# EasyEDA Pro project ProDoc_D133手机主板V0.2_2024-07-06.epro, schematic Schematic1_1

## Sheets
1 MCU
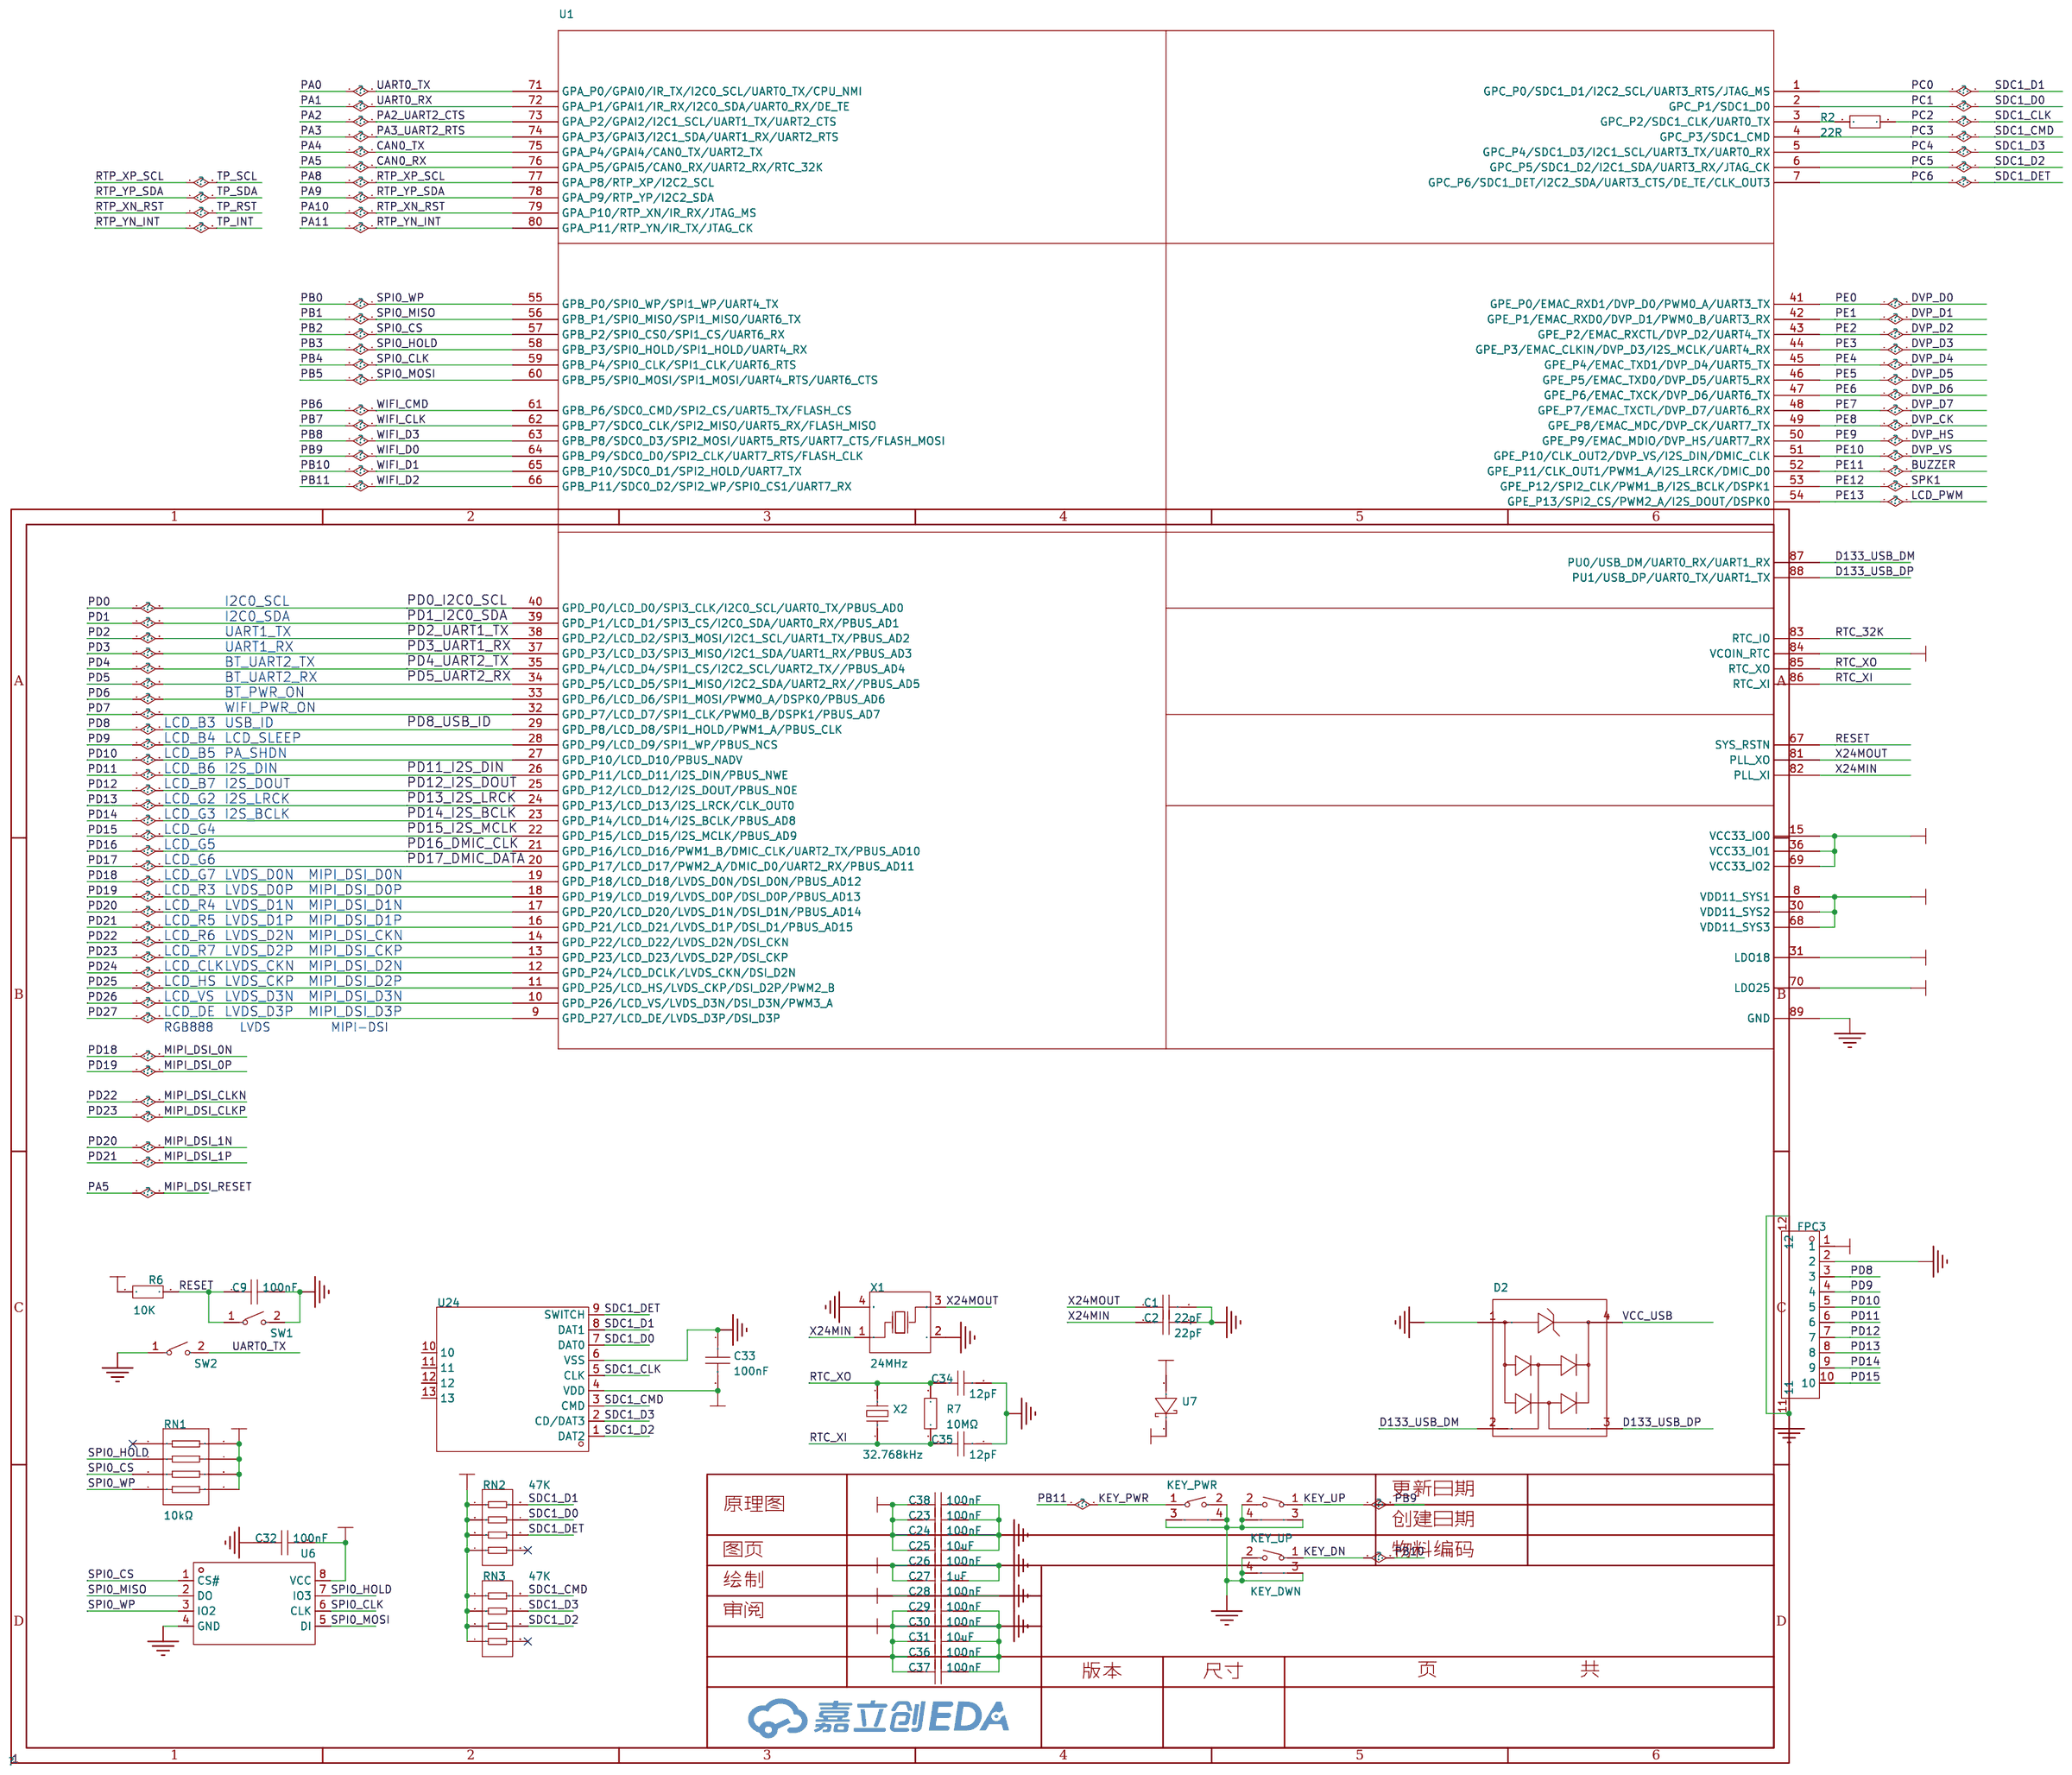
[diagram p0: MCU]
2 LCD
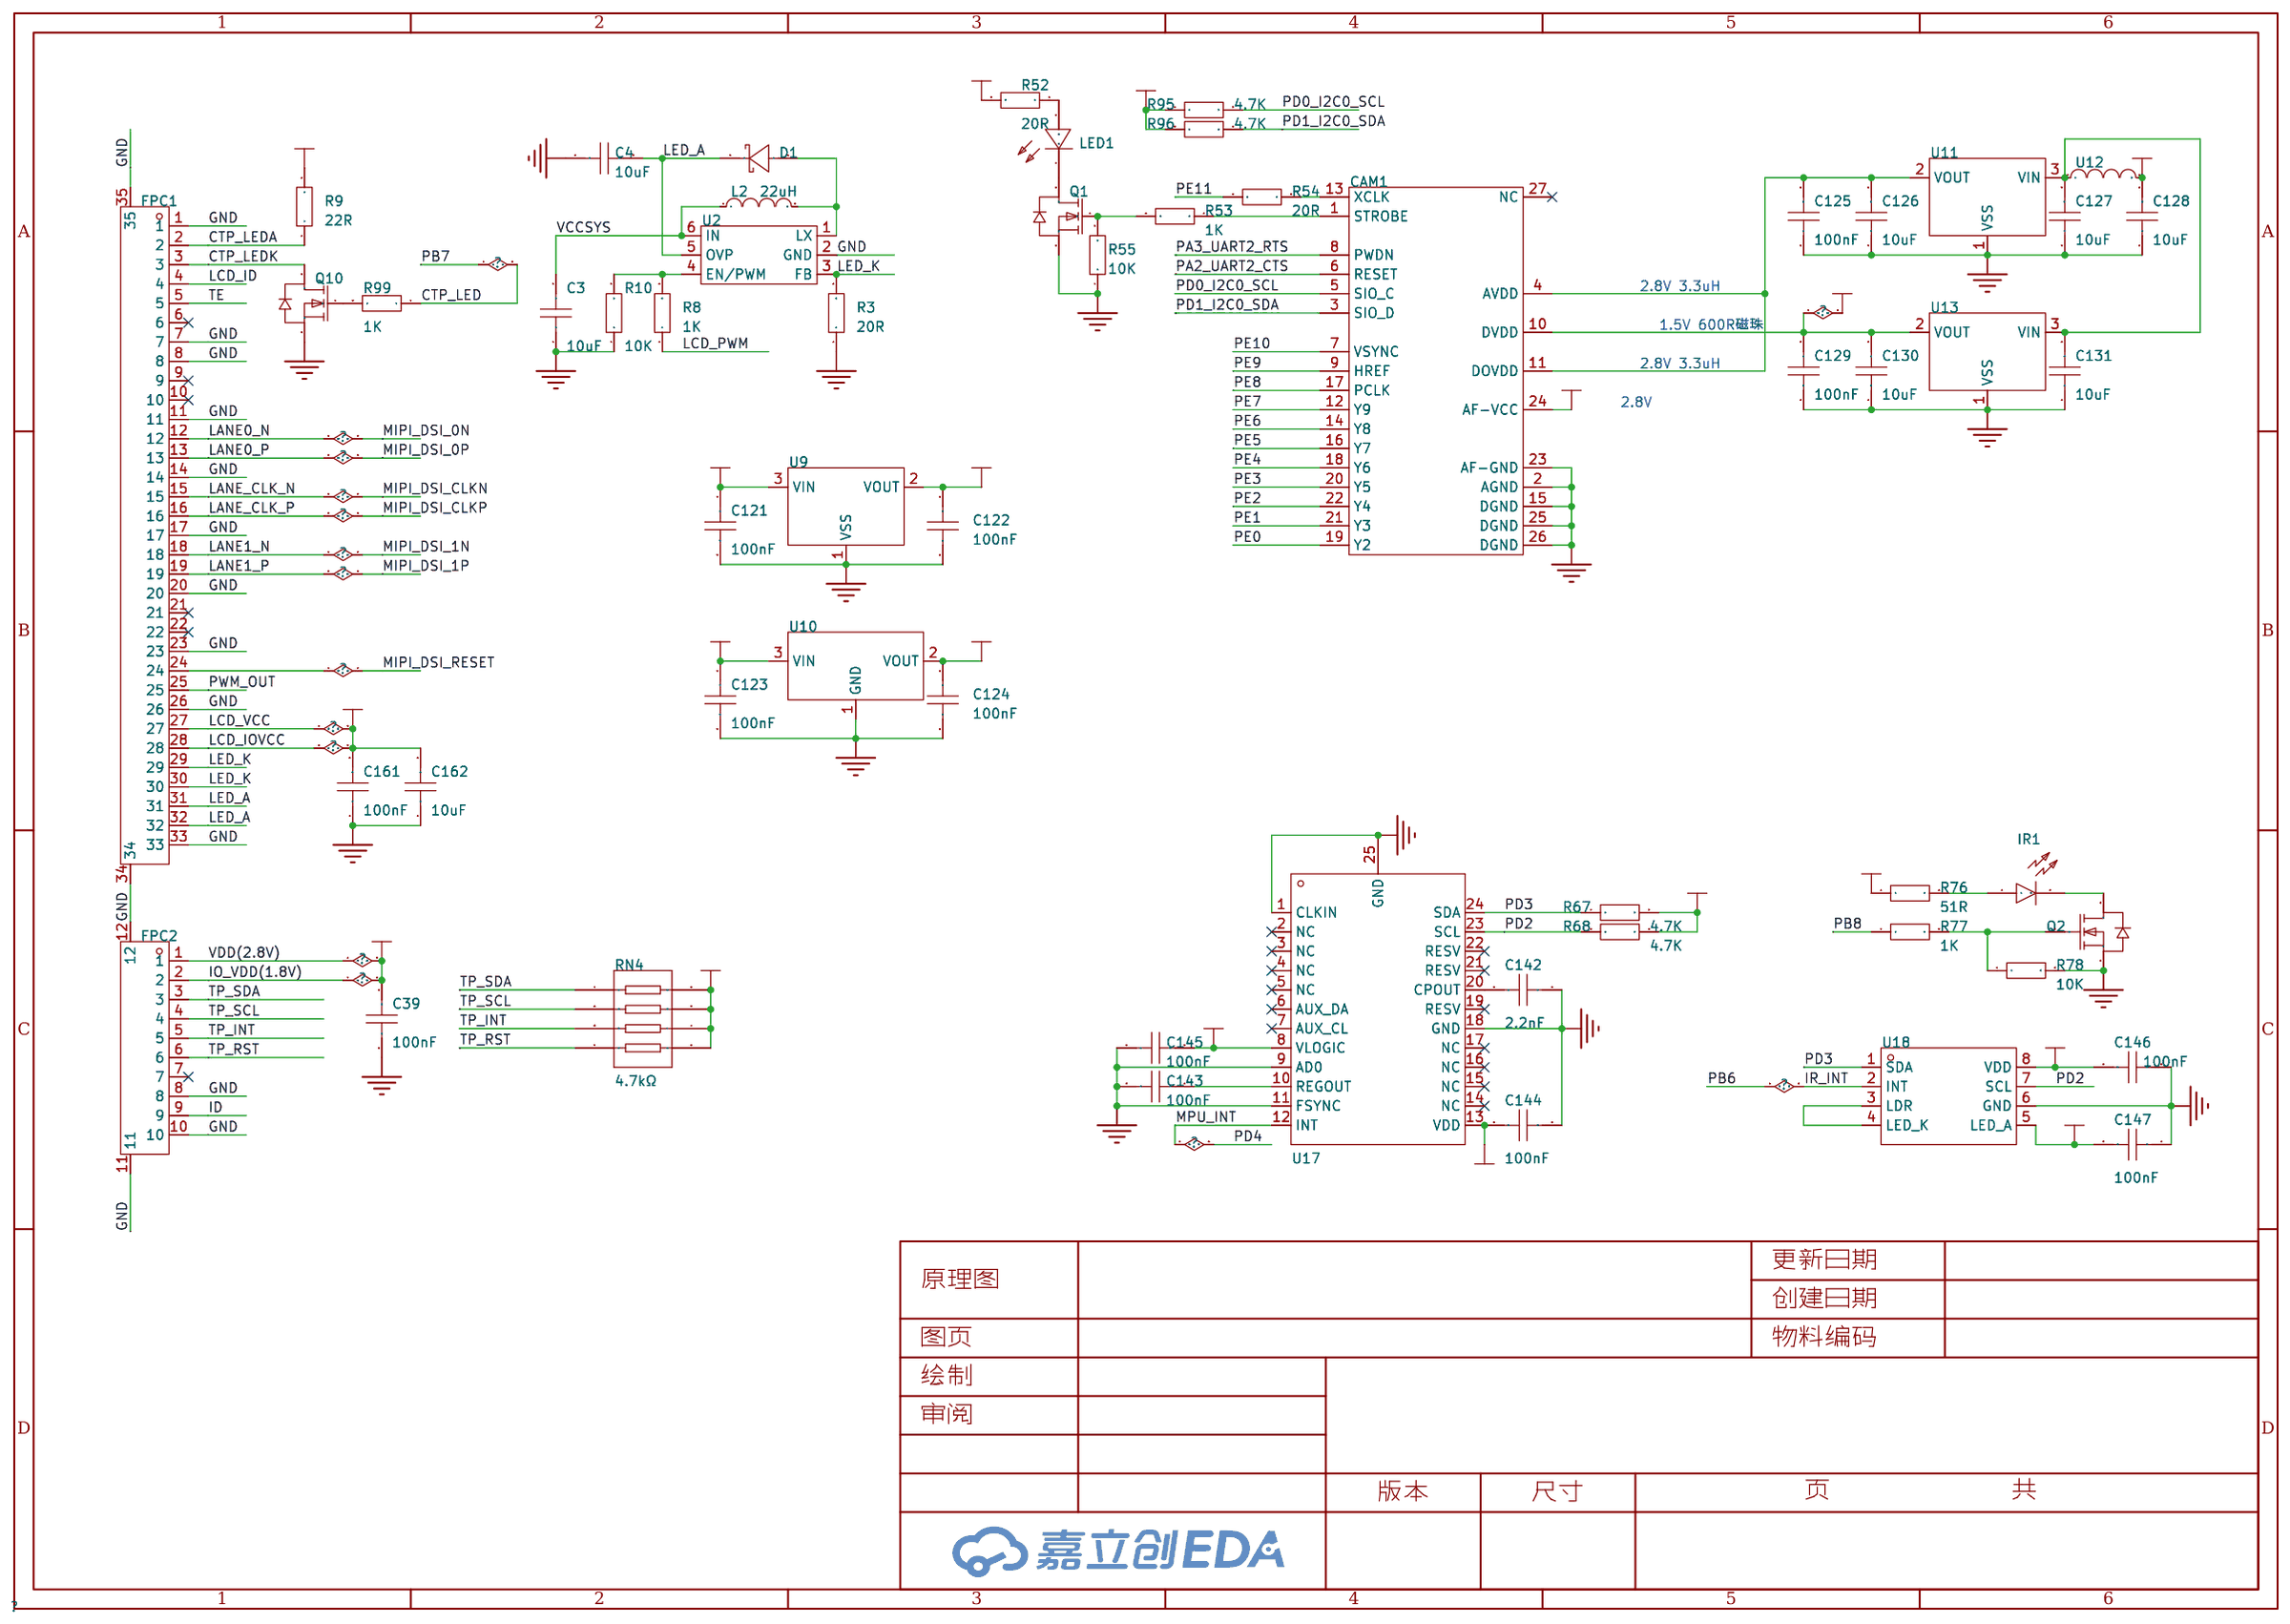
[diagram p1: LCD]
3 POWER
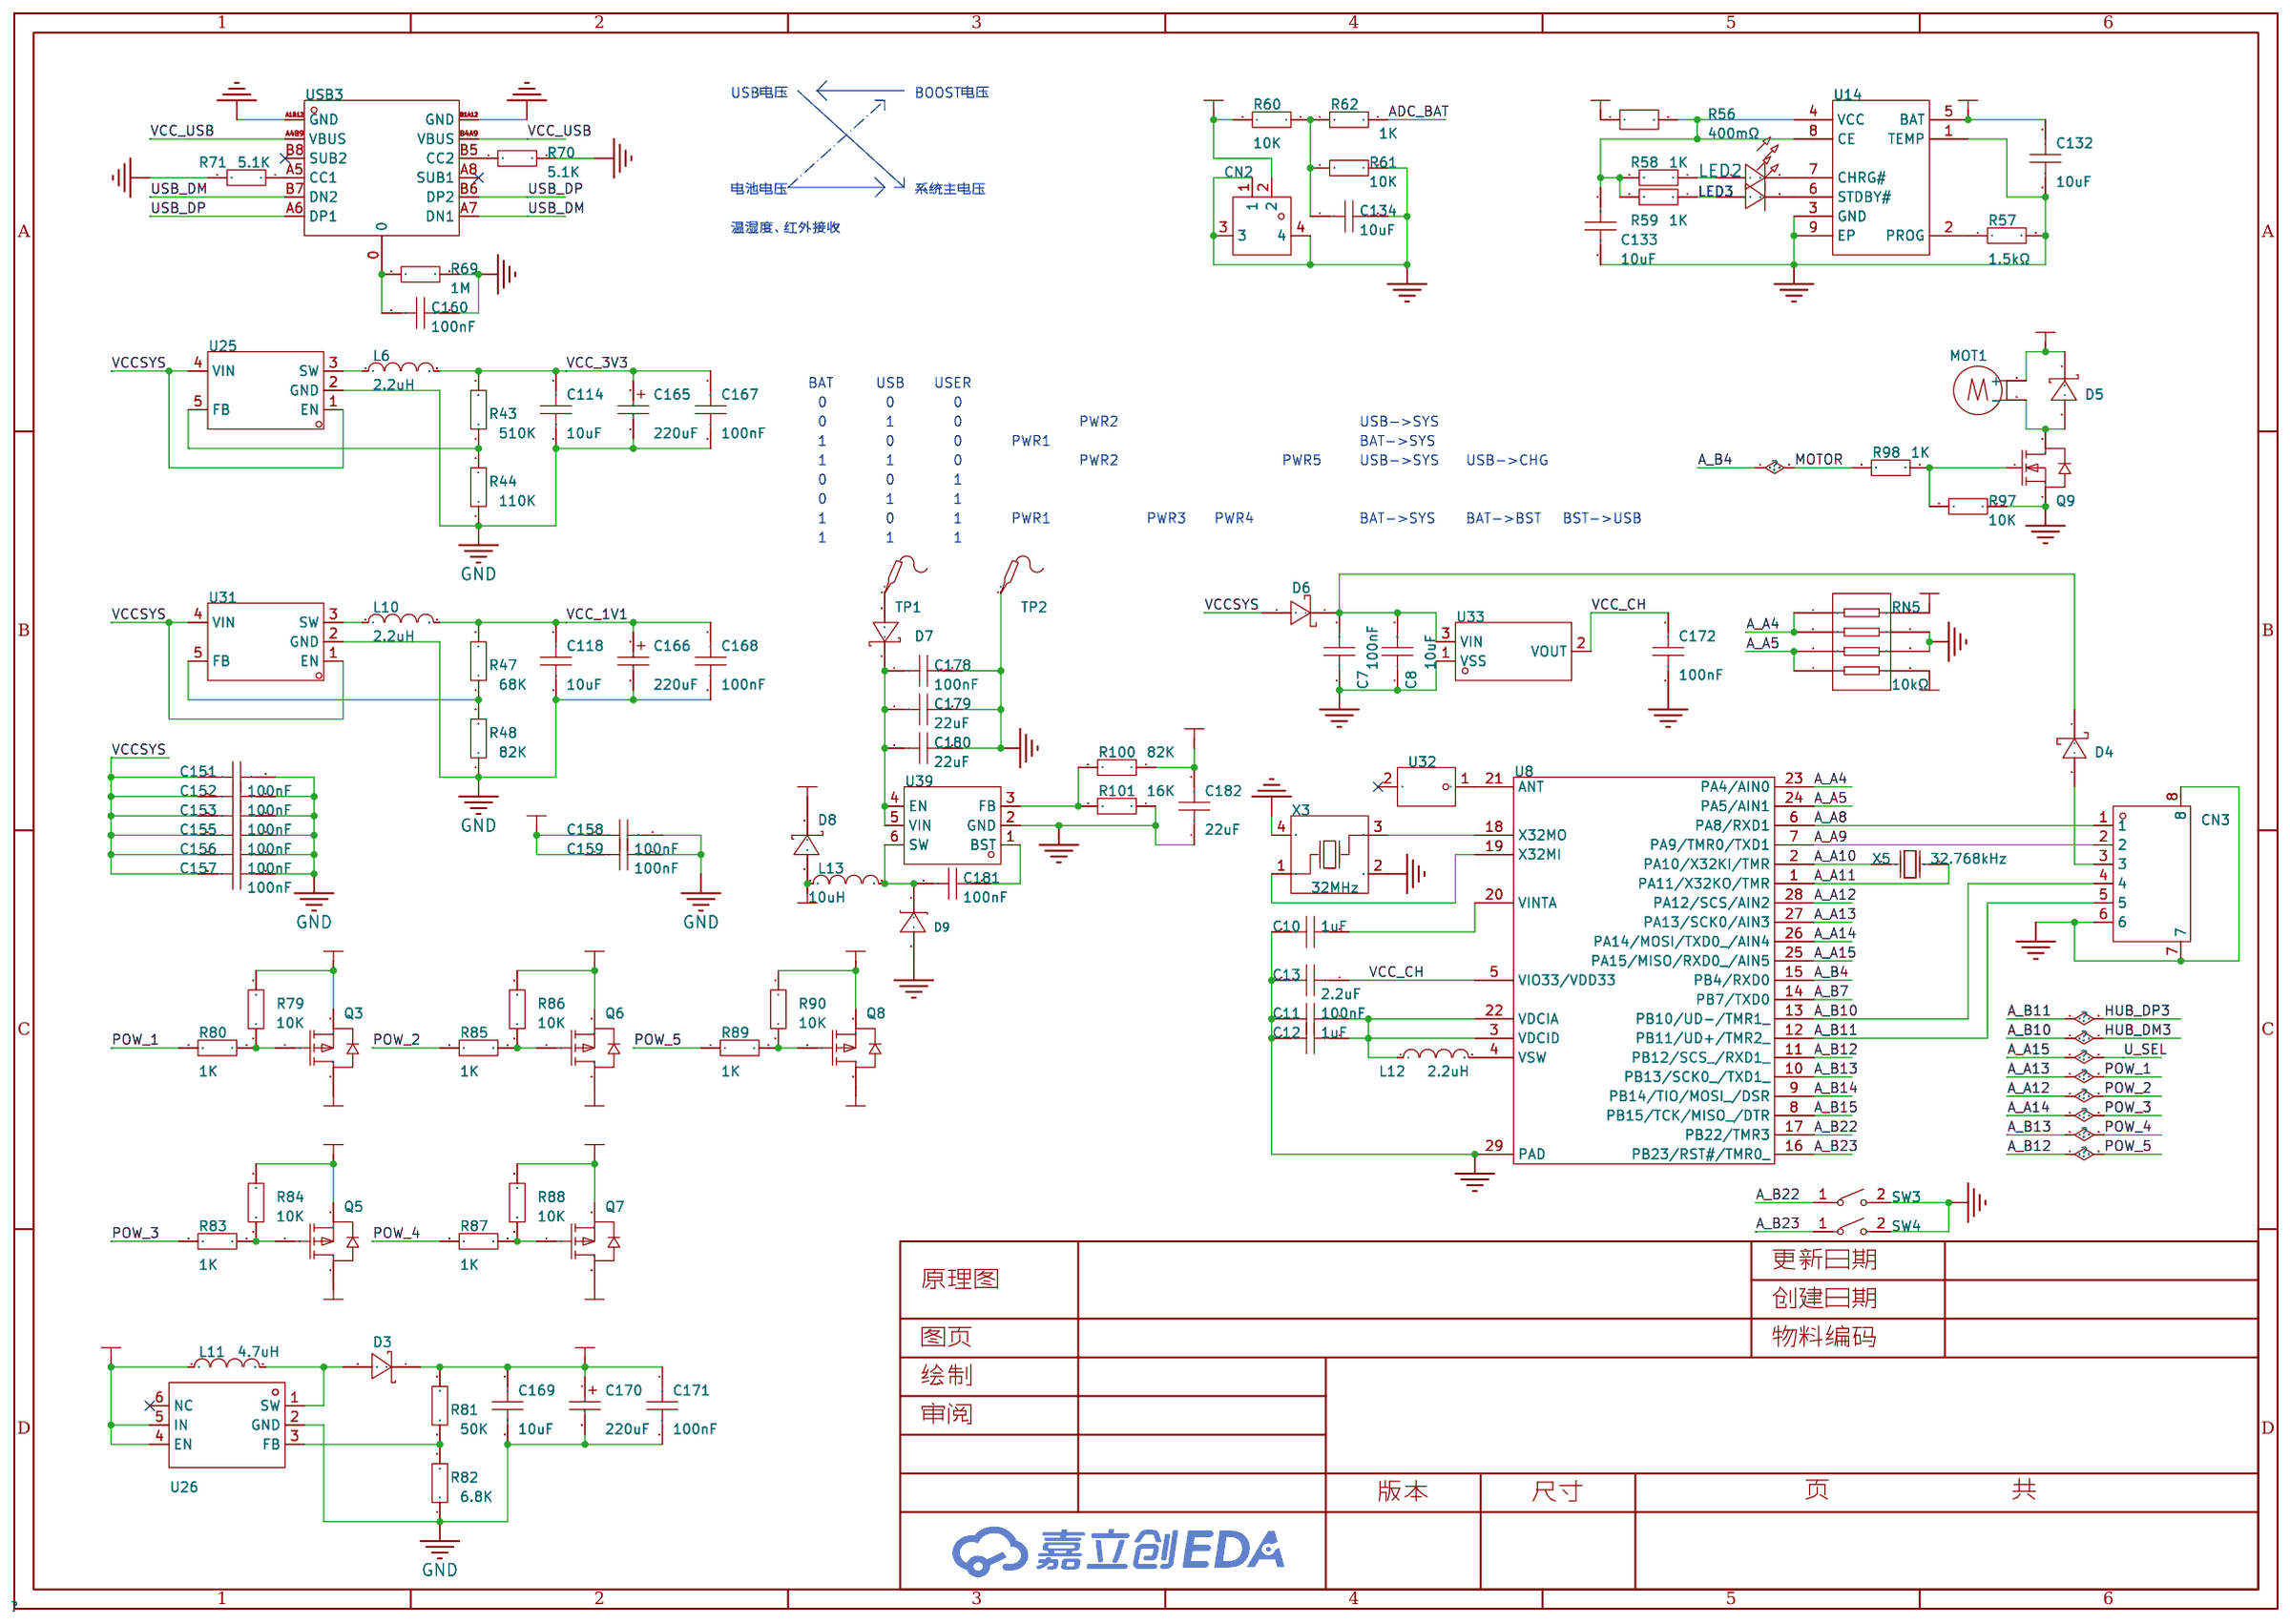
[diagram p2: POWER]
4 AUDIO
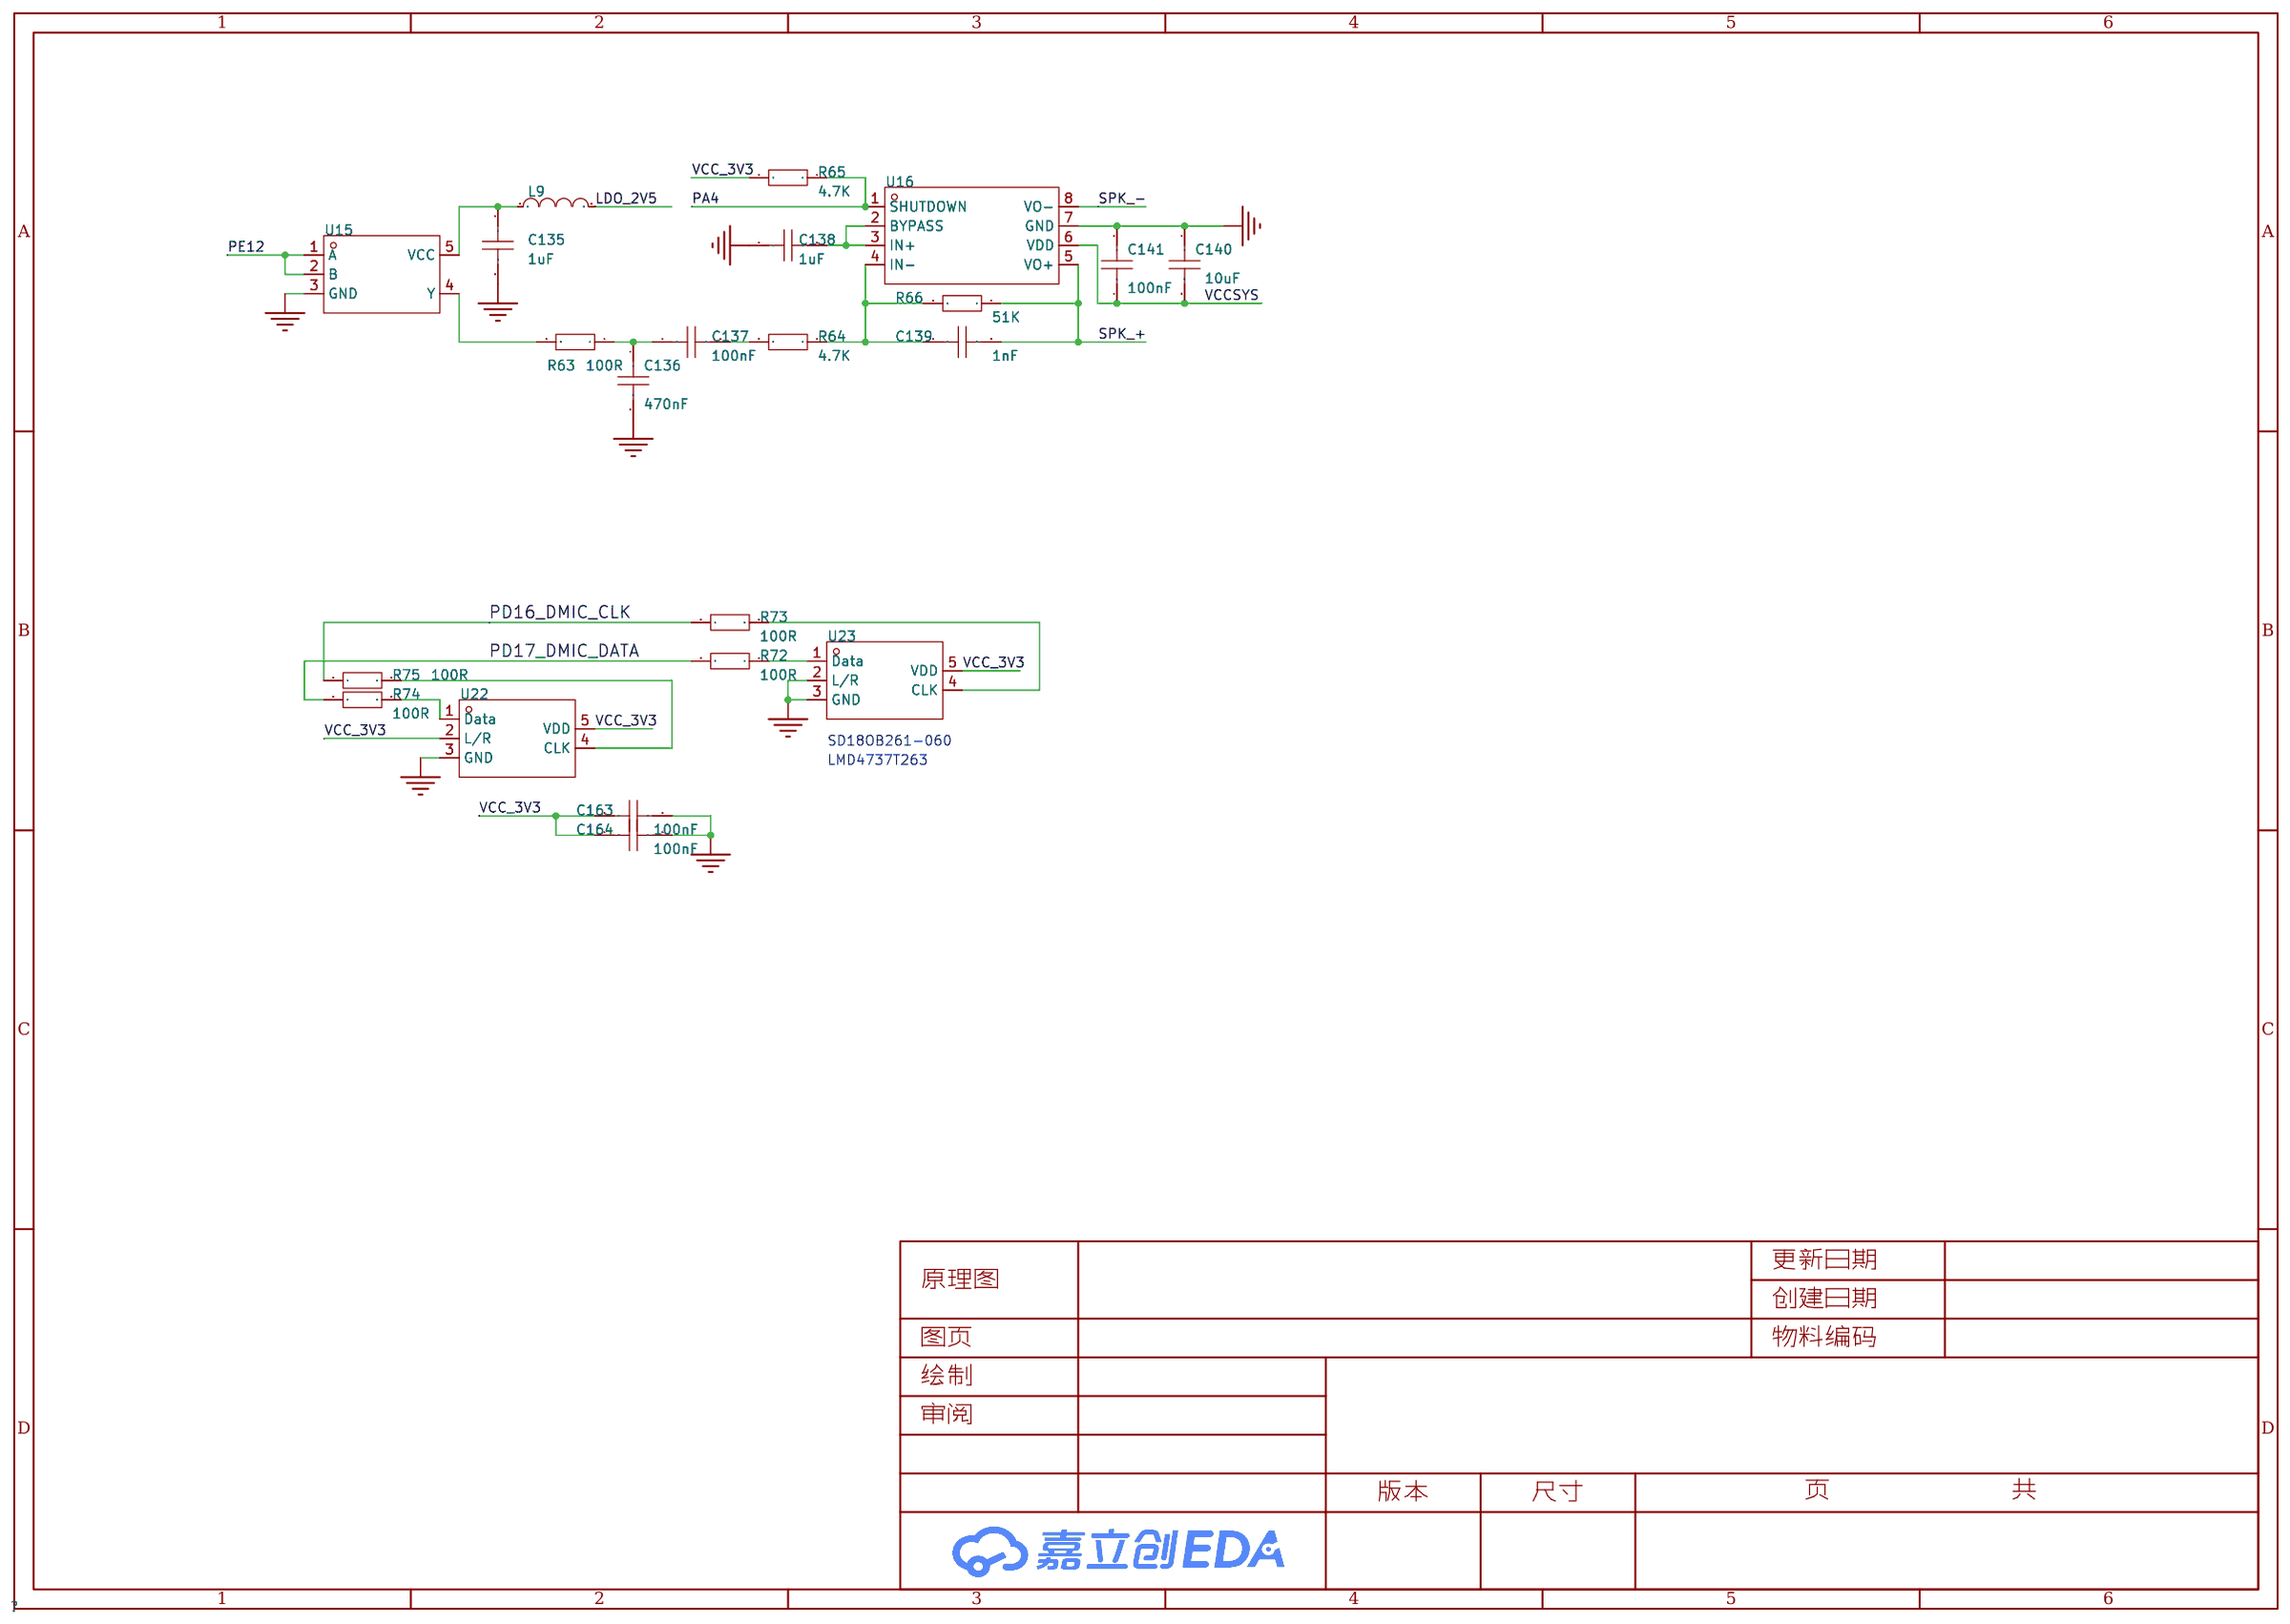
[diagram p3: AUDIO]
5 USB
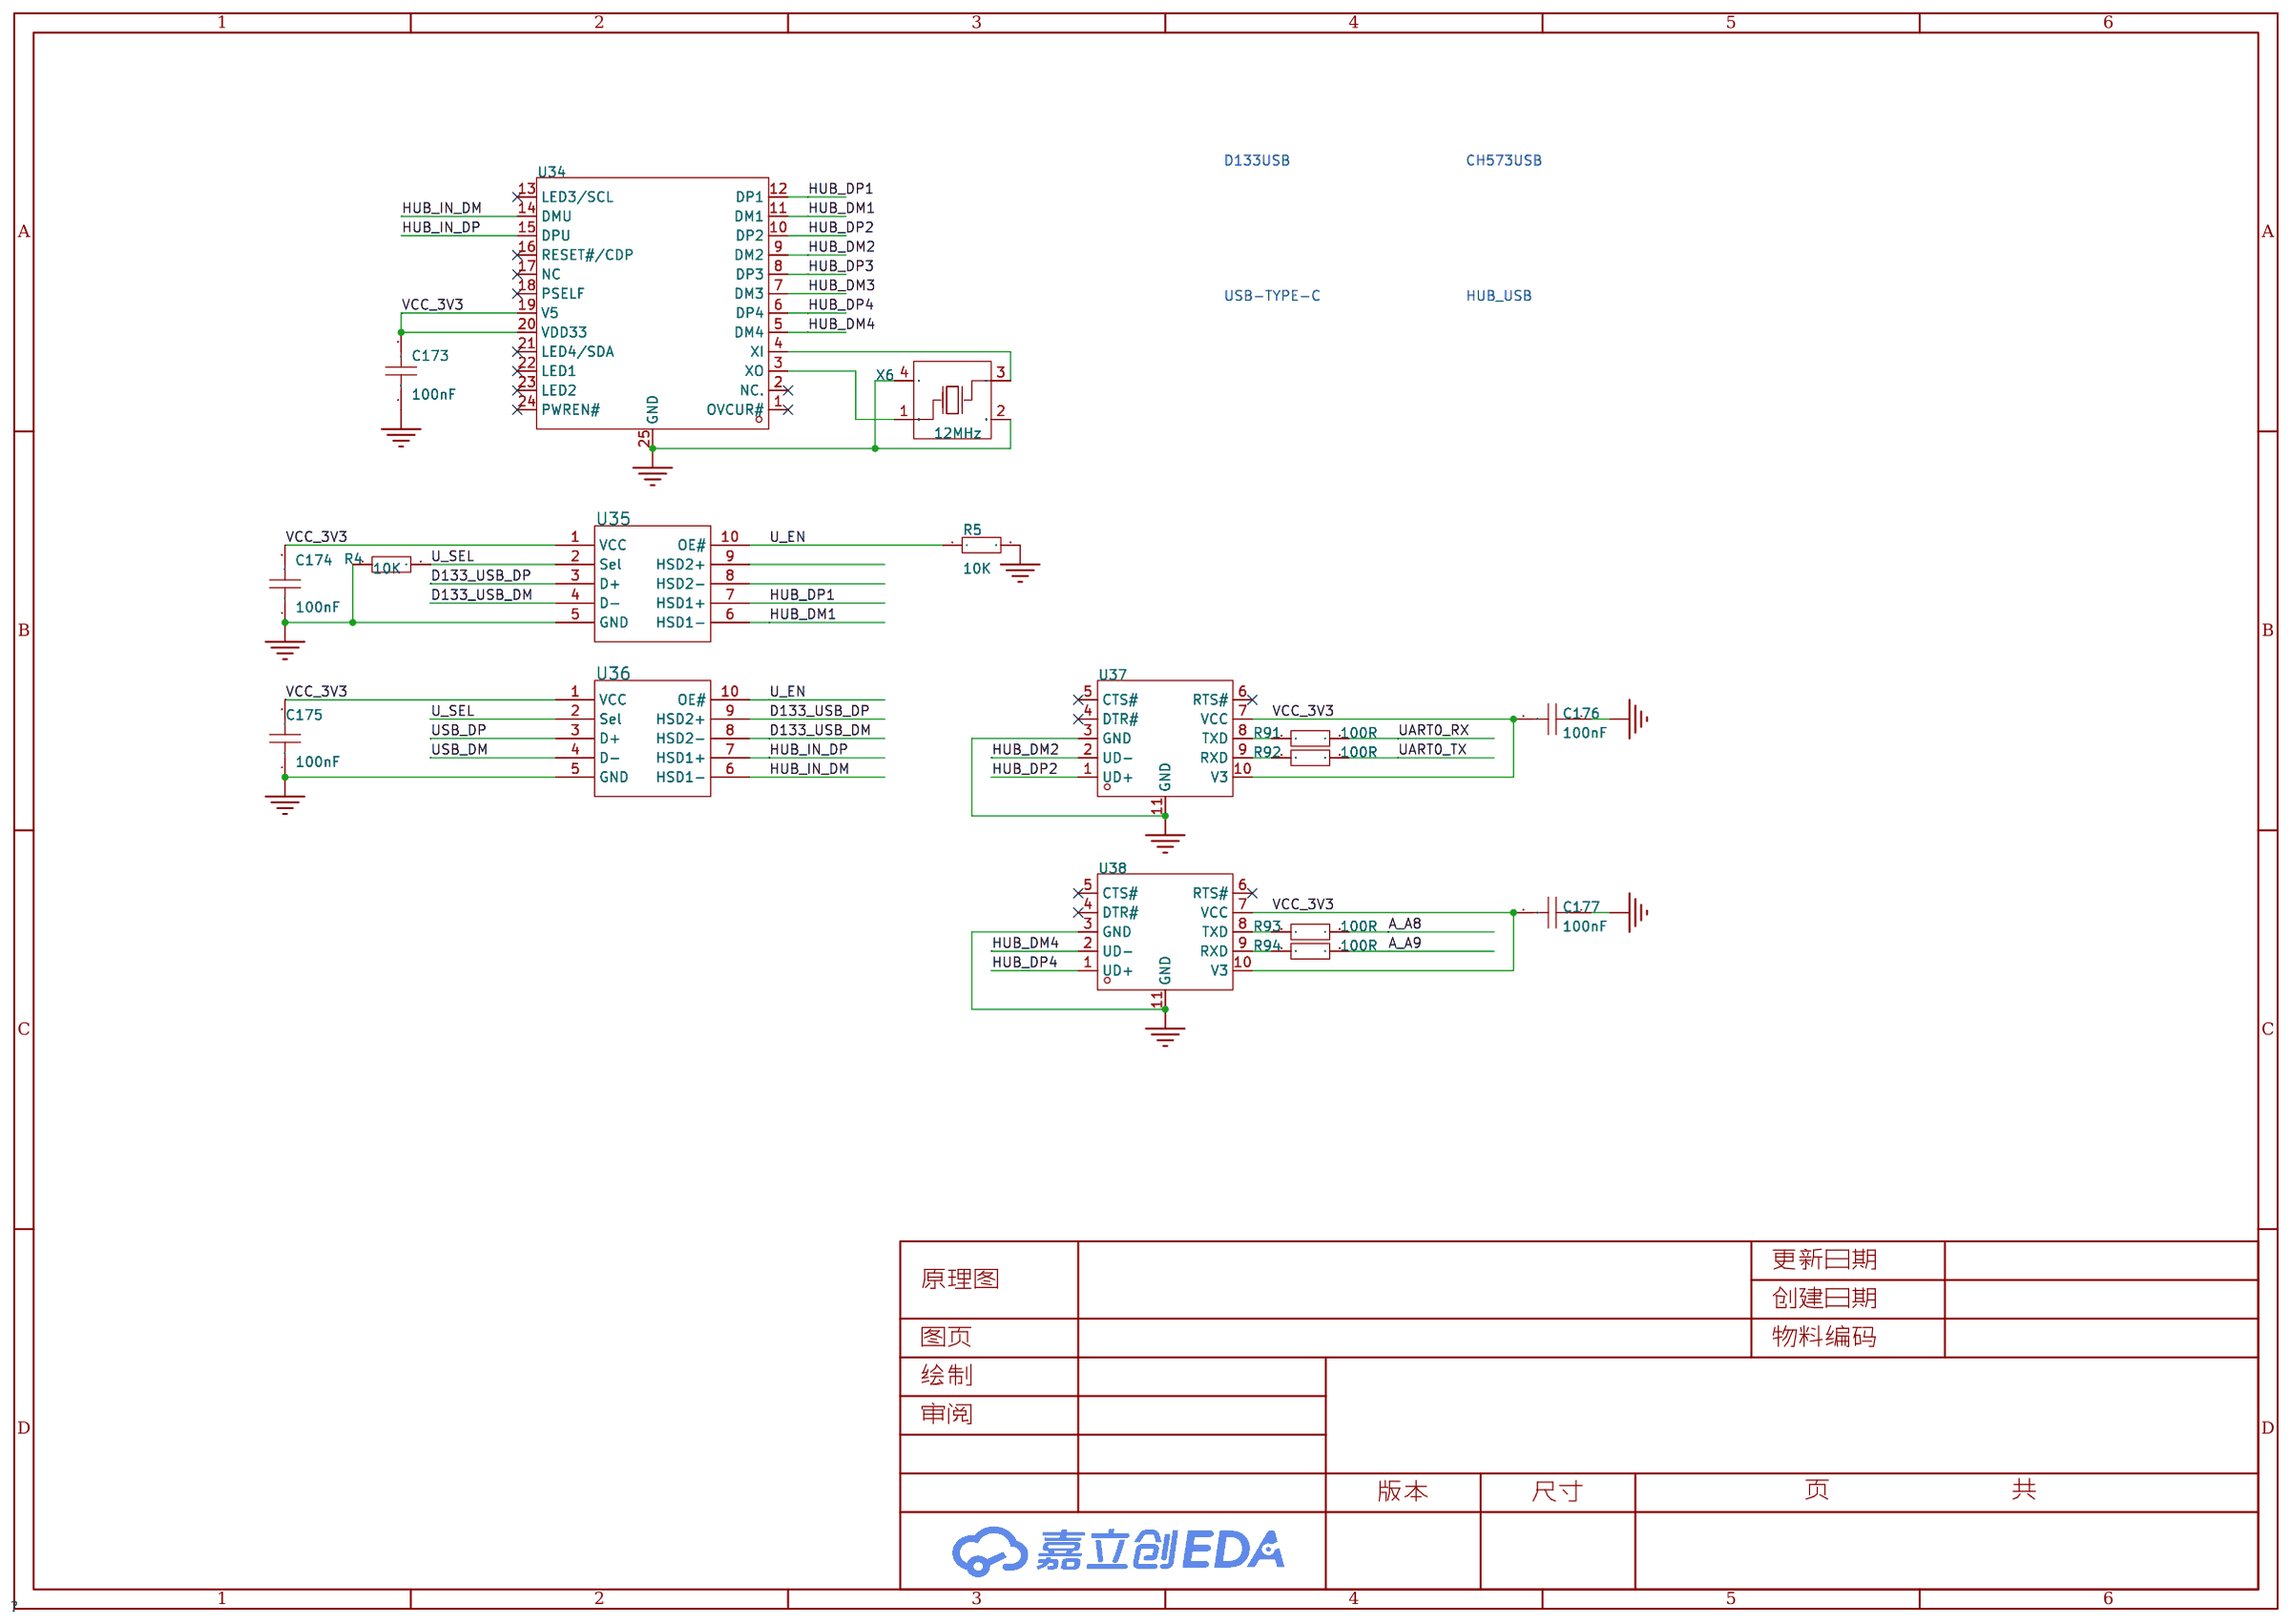
[diagram p4: USB]

## Parts
sheet AUDIO
C135  1uF  [C0603]
C136  470nF  [C0603]
C137  100nF  [C0603]
C138  1uF  [C0603]
C139  1nF  [C0603]
C140  10uF  [C0603]
C141  100nF  [C0603]
C163  100nF  [C0603]
C164  100nF  [C0603]
L9  BLM18AG601SN1D  [L0603]
R63  100R  [R0603]
R64  4.7K  [R0603]
R65  4.7K  [R0603]
R66  51K  [R0603]
R72  100R  [R0603]
R73  100R  [R0603]
R74  100R  [R0603]
R75  100R  [R0603]
U15  U74LVC1G08G  [SOT-353-5_L2.0-W1.3-P0.65-LS2.1-BR]
U16  LM4871  [SOIC-8_L4.9-W3.9-P1.27-LS6.0-BL]
U22  SD18OB261-060  [MIC-SMD_SD18OB261-060]
U23  SD18OB261-060  [MIC-SMD_SD18OB261-060]
sheet LCD
C3  10uF  [C0603]
C4  10uF  [C0603]
C39  100nF  [C0603]
C121  100nF  [C0603]
C122  100nF  [C0603]
C123  100nF  [C0603]
C124  100nF  [C0603]
C125  100nF  [C0603]
C126  10uF  [C0603]
C127  10uF  [C0603]
C128  10uF  [C0603]
C129  100nF  [C0603]
C130  10uF  [C0603]
C131  10uF  [C0603]
C142  2.2nF  [C0603]
C143  100nF  [C0603]
C144  100nF  [C0603]
C145  100nF  [C0603]
C146  100nF  [C0603]
C147  100nF  [C0603]
C161  100nF  [C0603]
C162  10uF  [C0603]
CAM1  OV2640  [OV5640]
D1  1N4148W  [SOD-123_L2.7-W1.6-LS3.7-FD]
FPC1  0.3K-QX-33PWB  [FPC-SMD_33P-P0.30_HDGC_0.3K-QX-33PWB]
FPC2  HC-FPC-05-10-10RLTAG  [FPC-SMD_10P-P0.50_HCTL_HC-FPC-05-10-10RLTAG]
IR1  IR26-51C/L110/TR8  [OPTO-SMD_L3.0-W2.6_IR26-51C-L110-TR8]
L2  22uH  [IND-SMD_L3.0-W3.0]
LED1  HL-AM-2835H489W-S1-08HL-HR3  [LED-SMD_L3.3-W2.8-RD]
Q1  AO3400A  [SOT-23-3_L2.9-W1.3-P1.90-LS2.4-BR]
Q2  2N7002K  [SOT-23-3_L2.9-W1.3-P1.90-LS2.4-BR]
Q10  AO3400A  [SOT-23-3_L2.9-W1.3-P1.90-LS2.4-BR]
R3  20R  [R0603]
R8  1K  [R0603]
R9  22R  [R0603]
R10  10K  [R0603]
R52  20R  [R0603]
R53  1K  [R0603]
R54  20R  [R0603]
R55  10K  [R0603]
R67  4.7K  [R0603]
R68  4.7K  [R0603]
R76  51R  [R0603]
R77  1K  [R0603]
R78  10K  [R0603]
R95  4.7K  [R0603]
R96  4.7K  [R0603]
R99  1K  [R0603]
RN4  4.7kΩ  [RES-ARRAY-SMD_0603-8P-L3.2-W1.6-BL]
U2  SY7200AABC  [SOT-23-6_L2.9-W1.6-P0.95-LS2.8-BR]
U9  XC6206P282MR  [SOT-23-3_L2.9-W1.3-P0.95-LS2.4-BR]
U10  LR8103A-T12  [SOT-23-3_L2.9-W1.6-P1.90-LS2.8-BR]
U11  XC6206P282MR  [SOT-23-3_L2.9-W1.3-P0.95-LS2.4-BR]
U12  BLM18PG121SN1D  [L0603]
U13  XC6206P152MR  [SOT-23-3_L2.9-W1.3-P0.95-LS2.4-BR]
U17  MPU-6050  [QFN-24_L4.0-W4.0-P0.50-BL-EP2.7]
U18  LTR-553ALS-01  [SENSOR-SMD_L3.9-W2.4-P0.95-BL]
sheet MCU
C1  22pF  [C0603]
C2  22pF  [C0603]
C9  100nF  [C0603]
C23  100nF  [C0603]
C24  100nF  [C0603]
C25  10uF  [C0603]
C26  100nF  [C0603]
C27  1uF  [C0603]
C28  100nF  [C0603]
C29  100nF  [C0603]
C30  100nF  [C0603]
C31  10uF  [C0603]
C32  100nF  [C0603]
C33  100nF  [C0603]
C34  12pF  [C0603]
C35  12pF  [C0603]
C36  100nF  [C0603]
C37  100nF  [C0603]
C38  100nF  [C0603]
D2  SR05  [SOT-143_L2.9-W1.3-P1.92-LS2.3-BR]
FPC3  HC-FPC-05-10-10RLTAG  [FPC-SMD_10P-P0.50_HCTL_HC-FPC-05-10-10RLTAG]
KEY_DWN  YTS1C0033BBG01  [SW-SMD_YIYUAN_YTS1C003XXX]
KEY_PWR  YTS1C0033BBG01  [SW-SMD_YIYUAN_YTS1C003XXX]
KEY_UP  YTS1C0033BBG01  [SW-SMD_YIYUAN_YTS1C003XXX]
R2  22R  [R0603]
R6  10K  [R0603]
R7  10MΩ  [R0603]
RN1  10kΩ  [RES-ARRAY-SMD_0603-8P-L3.2-W1.6-BL]
RN2  47K  [RES-ARRAY-SMD_0603-8P-L3.2-W1.6-BL]
RN3  47K  [RES-ARRAY-SMD_0603-8P-L3.2-W1.6-BL]
SW1  TS-1088R-02026  [SW-SMD_L3.9-W3.0-P4.45]
SW2  TS-1088R-02026  [SW-SMD_L3.9-W3.0-P4.45]
U1  D133CBS  [QFN-88_L10.0-W10.0-P0.40-BL-EP]
U6  W25Q128JVSIQ  [SOIC-8_L5.3-W5.3-P1.27-LS8.0-BL]
U7  1N5819W  [SOD-123_L2.7-W1.6-LS3.7-FD]
U24  TF-123-ARP9H15  [TF-SMD_TF-123-ARP9H15]
X1  24MHz  [CRYSTAL-SMD_4P-L3.2-W2.5-BL]
X2  32.768kHz  [OSC-SMD_L3.2-W1.5]
sheet POWER
C7  100nF  [C0603]
C8  10uF  [C0603]
C10  1uF  [C0603]
C11  100nF  [C0603]
C12  1uF  [C0603]
C13  2.2uF  [C0603]
C114  10uF  [C0603]
C118  10uF  [C0603]
C132  10uF  [C0603]
C133  10uF  [C0603]
C134  10uF  [C0603]
C151  100nF  [C1206]
C152  100nF  [C1206]
C153  100nF  [C1206]
C155  100nF  [C0805]
C156  100nF  [C0805]
C157  100nF  [C0603]
C158  100nF  [C1206]
C159  100nF  [C1206]
C160  100nF  [C0603]
C165  220uF  [CASE-B_3528]
C166  220uF  [CASE-B_3528]
C167  100nF  [C0603]
C168  100nF  [C0603]
C169  10uF  [C0603]
C170  220uF  [CASE-B_3528]
C171  100nF  [C0603]
C172  100nF  [C0603]
C178  100nF  [C0603]
C179  22uF  [C0805]
C180  22uF  [C0805]
C181  100nF  [C0603]
C182  22uF  [C0805]
CN2  1.25-2PWB  [CONN-SMD_2P-P1.25_DEALON_1.25-2PWB]
CN3  A1002WR-S-6P  [CONN-SMD_A1002WR-S-6P]
D3  SS34  [SMA_L4.3-W2.6-LS5.2-RD]
D4  B5819W SL  [SOD-123_L2.7-W1.6-LS3.7-RD-1]
D5  1N5819HW-7-F  [SOD-123_L2.7-W1.6-LS3.7-RD]
D6  B5819W SL  [SOD-123_L2.7-W1.6-LS3.7-RD-1]
D7  1N5819WS  [SOD-323_L1.8-W1.3-LS2.5-RD]
D8  1N5819WS  [SOD-323_L1.8-W1.3-LS2.5-RD]
D9  PMEG6020ELRX  [SOD-123_L2.8-W1.8-LS3.7-RD]
L6  2.2uH  [IND-SMD_L3.0-W3.0_FNR30XXS]
L10  2.2uH  [IND-SMD_L3.0-W3.0_FNR30XXS]
L11  4.7uH  [IND-SMD_L4.4-W4.2]
L12  2.2uH  [L0805]
L13  10uH  [IND-SMD_L4.0-W4.0]
LED2  -  [led_0603]
LED3  -  [led_0603]
MOT1  LCM1027A2445F  [VIBRATING-MOTOR-SMD_WELDING]
Q3  AO3401A  [SOT-23_L2.9-W1.3-P1.90-LS2.4-BR]
Q5  AO3401A  [SOT-23_L2.9-W1.3-P1.90-LS2.4-BR]
Q6  AO3401A  [SOT-23_L2.9-W1.3-P1.90-LS2.4-BR]
Q7  AO3401A  [SOT-23_L2.9-W1.3-P1.90-LS2.4-BR]
Q8  AO3401A  [SOT-23_L2.9-W1.3-P1.90-LS2.4-BR]
Q9  AO3400A  [SOT-23-3_L2.9-W1.3-P1.90-LS2.4-BR]
R43  510K  [R0603]
R44  110K  [R0603]
R47  68K  [R0603]
R48  82K  [R0603]
R56  400mΩ  [R1206]
R57  1.5kΩ  [R0603]
R58  1K  [R0603]
R59  1K  [R0603]
R60  10K  [R0603]
R61  10K  [R0603]
R62  1K  [R0603]
R69  1M  [R0603]
R70  5.1K  [R0603]
R71  5.1K  [R0603]
R79  10K  [R0603]
R80  1K  [R0603]
R81  50K  [R0603]
R82  6.8K  [R0603]
R83  1K  [R0603]
R84  10K  [R0603]
R85  1K  [R0603]
R86  10K  [R0603]
R87  1K  [R0603]
R88  10K  [R0603]
R89  1K  [R0603]
R90  10K  [R0603]
R97  10K  [R0603]
R98  1K  [R0603]
R100  82K  [R0603]
R101  16K  [R0603]
RN5  10kΩ  [RES-ARRAY-SMD_0603-8P-L3.2-W1.6-BL]
SW3  TS-1088R-02026  [SW-SMD_L3.9-W3.0-P4.45]
SW4  TS-1088R-02026  [SW-SMD_L3.9-W3.0-P4.45]
TP1  -  [Test-Point-0.5mm]
TP2  -  [Test-Point-0.5mm]
U8  U3  [qfn-28_l4.0-w4.0-p0.40-tl-ep2.6]
U14  TP4056-42-ESOP8  [ESOP-8_L4.9-W3.9-P1.27-LS6.0-BL-EP]
U25  TLV62569DBVR  [SOT-23-5_L3.0-W1.7-P0.95-LS2.8-BR]
U26  MT3608  [SOT-23-6_L2.9-W1.6-P0.95-LS2.8-BL]
U31  TLV62569DBVR  [SOT-23-5_L3.0-W1.7-P0.95-LS2.8-BR]
U32  ANT3216LL00R2400A  [ant-smd_l3.2-w1.6_slk-ssd-3216m-ant2.4g]
U33  XC6206-3.3V  [SSOT-3_L2.9-W1.6-P0.95-LS2.8-BR]
U39  LGS5145  [SOT-23-6_L2.9-W1.7-P0.95-LS2.8-BL]
USB3  TYPE-C 16P CB0.8 073  [USB-C-SMD_TYPE-C-16P-CB0.8-073]
X3  32MHz  [crystal-smd_4p-l2.5-w2.0-bl-a]
X5  32.768kHz  [CRYSTAL-SMD_L3.2-W1.5-1]
sheet USB
C173  100nF  [C0603]
C174  100nF  [C0603]
C175  100nF  [C0603]
C176  100nF  [C0603]
C177  100nF  [C0603]
R4  10K  [R0603]
R5  10K  [R0603]
R91  100R  [R0603]
R92  100R  [R0603]
R93  100R  [R0603]
R94  100R  [R0603]
U34  CH334F  [QFN-24_L4.0-W4.0-P0.50-BL-EP2.8]
U35  FSUSB42MUX  [MSOP-10_L3.0-W3.0-P0.50-LS5.0-BL]
U36  FSUSB42MUX  [MSOP-10_L3.0-W3.0-P0.50-LS5.0-BL]
U37  CH340K  [ESOP-10_L4.9-W3.9-P1.00-LS6.0-BL-EP]
U38  CH340K  [ESOP-10_L4.9-W3.9-P1.00-LS6.0-BL-EP]
X6  12MHz  [OSC-SMD_4P-L3.2-W2.5-BL]

## Library data of the parts
C114 C118 C121-C124 C132-C141 C163 C164 C167-C169 C171 C178 C181 = CL10A106MA8NRNC: 容值:10uF;精度:±20%;额定电压:25V;温度系数:X5R;; LCSC Part Name: 10uF ±20% 25V; Supplier Part: C96446; Manufacturer: SAMSUNG(三星); Supplier Footprint: 0603; JLCPCB Part Class: 基础库; Datasheet: https://atta.szlcsc.com/upload/public/pdf/source/20170325/1490427913016.pdf; Supplier: LCSC; Tolerance: ±20%; Voltage Rated: 25V; Temperature Coefficient: X5R
L9 = BLM18AG601SN1D: 标称阻抗@测试频率:600Ω@100MHz;误差:±25%;直流电阻(RDC):380mΩ;; LCSC Part Name: 单路 0603磁珠 阻抗600Ω@100MHz; Supplier Part: C19330; Manufacturer: muRata(村田); Supplier Footprint: 0603; JLCPCB Part Class: 扩展库; Datasheet: https://atta.szlcsc.com/upload/public/pdf/source/20180329/C160981_FD3C2D2622A377E203B89F4AA32B0741.pdf; Supplier: LCSC; Impedance @ Frequency: 600Ω@100MHz; Tolerance: ±25%; DC Resistance: 380mΩ; Current Rating: 500mA; Circuits: 1
R44 R48 R58-R66 R72-R75 R79 R80 R82-R90 R97 R98 R100 R101 = 0603WAF1502T5E: LCSC Part Name: 15KΩ(1502) ±1% 编带; Supplier Part: C22809; Manufacturer: UNI-ROYAL(厚声); Supplier Footprint: 0603; JLCPCB Part Class: 基础库; Datasheet: https://atta.szlcsc.com/upload/public/pdf/source/20170920/C22809_1505887473690980606.pdf; Supplier: LCSC
U15 = U74LVC1G08G: Supplier Part: C7494898; Manufacturer: UTC(友顺); Supplier Footprint: SOT-353; JLCPCB Part Class: 扩展库; Datasheet: https://atta.szlcsc.com/upload/public/pdf/source/20230718/731A97F03DFF03A953CF98E5B6C56EC5.pdf; Supplier: LCSC
U16 = LM4871_C7494970: 音频功率放大器@@单声道带关断模式，桥式音频功率放大器。在输入1KHz,5V工作电压时，最大驱动功 率为：3W（4Ω负载，THD&lt;10%），2W（4Ω负载，THD&lt;1%）；音频范围内总谐波失真噪音小于1%（20Hz-20KHz）； 应用电路简单，只需要极少数外围器件，就能提供高品质的输出功率。输出不需要外接耦合电容或 上举电容、缓冲网络、反馈电阻。; Supplier: LCSC; Supplier Part: C7494970; Manufacturer: IDCHIP(英锐芯); JLCPCB Part Class: 扩展库; Supplier Footprint: SOP-8; Datasheet: https://atta.szlcsc.com/upload/public/pdf/source/20231229/73188F9C05492146B0D4BFC0A6E99E2B.pdf
U22 = SD18OB261-060: 方向:-;信噪比:-;灵敏度:-;阻抗:-;; Supplier Part: C2895290; Manufacturer: Goertek(歌尔); JLCPCB Part Class: 扩展库; Supplier: LCSC
U23 = SD18OB261-060: 方向:-;信噪比:-;灵敏度:-;阻抗:-;; Supplier Part: C2895290; Manufacturer: Goertek(歌尔); JLCPCB Part Class: 扩展库; Datasheet: https://atta.szlcsc.com/upload/public/pdf/source/20220908/42C65A10ECC5E123C7A6D90000D9CF1D.pdf; Supplier: LCSC
C1-C4 C7-C13 C23-C39 C125-C131 C142-C147 C157 C160-C162 C172-C177 = CAP_0603: Supplier Footprint: 0603
CAM1 = OV5640: _: 3
D1 = 1N4148W_C7420318: 二极管配置:独立式;正向压降(Vf):1.25V@150mA;直流反向耐压(Vr):100V;平均整流电流(Io):150mA;功率:400mW;反向恢复时间(trr):4ns;; LCSC Part Name: 电压:100V 电流:150mA; Supplier Part: C7420318; Manufacturer: 宏迦橙; Supplier Footprint: SOD-123; JLCPCB Part Class: 扩展库; Datasheet: https://atta.szlcsc.com/upload/public/pdf/source/20230828/E5C3F7A4272052930A7E03B75759BF50.pdf; Supplier: LCSC; Diode Configuration: 独立式; Forward Voltage (Vf@If): 1.25V@150mA; Reverse Voltage (Vr): 100V; Average Rectified Current (Io): 150mA; Power Dissipation: 400mW; Reverse Leakage Current: 1uA@75V; Reverse Recovery Time (trr): 4ns; Operating Temperature: -55℃~+150℃
FPC1 = 0.3K-QX-33PWB: 锁定特性:翻盖式;触点类型:下接;触点数量:33P;间距:0.3mm;安装类型:卧贴;工作温度范围:-55℃~+85℃;; LCSC Part Name: 间距:0.3mm P数:33P 翻盖式 下接; Supplier Part: C2919513; Manufacturer: HDGC(华德共创); Supplier Footprint: SMD,P=0.3mm,卧贴; JLCPCB Part Class: 扩展库; Datasheet: https://atta.szlcsc.com/upload/public/pdf/source/20211115/D094DAB6FA6B8DC2D78D70ABC2FB15C4.pdf; Supplier: LCSC; Locking Feature: 翻盖式; Contact Type: 下接; Number of Contacts: 33P; Pitch: 0.3mm; Mounting Type: 卧贴; FFC, FCB Thickness: 0.2mm; Height Above Board: 1mm; Operating Temperature Range: -55℃~+85℃
FPC2 FPC3 = HC-FPC-05-10-10RLTAG: 锁定特性:翻盖式;触点类型:下接;触点数量:10P;间距:0.5mm;安装类型:卧贴;工作温度范围:-55℃~+85℃;; LCSC Part Name: 翻盖式 下接 P数:10P 间距:0.5mm; Supplier Part: C5213731; Manufacturer: HCTL(华灿天禄); Supplier Footprint: SMD,P=0.5mm,卧贴; JLCPCB Part Class: 扩展库; Datasheet: https://atta.szlcsc.com/upload/public/pdf/source/20221027/B2DE489DA152049D1F105170189CFB4E.pdf; Supplier: LCSC; Locking Feature: 翻盖式; Contact Type: 下接; Number of Contacts: 10P; Pitch: 0.5mm; Mounting Type: 卧贴; FFC, FCB Thickness: 0.3mm; Height Above Board: 1mm; Contact Material: 铜合金; Operating Temperature Range: -55℃~+85℃
IR1 = IR26-51C/L110/TR8: 辐射强度:-;; LCSC Part Name: IR26-51C/L110/TR8 侧贴; Supplier Part: C55975; Manufacturer: EVERLIGHT(亿光); Supplier Footprint: SMD,2.6x3mm; JLCPCB Part Class: 扩展库; Datasheet: https://atta.szlcsc.com/upload/public/pdf/source/20150821/1457707348000.pdf; Supplier: LCSC
L2 = YNR3015-220M: 电感值:22uH;精度:±20%;额定电流:520mA;; LCSC Part Name: 22uH ±20%; Supplier Part: C497564; Manufacturer: YJYCOIN(益嘉源); Supplier Footprint: SMD,3x3x1.5mm; JLCPCB Part Class: 扩展库; Datasheet: https://atta.szlcsc.com/upload/public/pdf/source/20200317/C497564_FCD7DDDF3C2F2D9A2B8B824571839590.pdf; Supplier: LCSC; Tolerance: ±20%; Rated Current: 520mA; DC Resistance (DCR): 460mΩ
LED1 = HL-AM-2835H489W-S1-08HL-HR3_C210311: 发光颜色:白色;正向电压(VF):3.4V;功率:306mW;正向电流:60mA;主波长:-;透镜颜色:雾状黄透镜;色温:4000K;发光角度:120°;载带方式:正贴;工作温度:-40℃~+85℃;; LCSC Part Name: 白灯 正贴 色温4000K; Supplier Part: C210311; Manufacturer: HONGLITRONIC(鸿利光电); Supplier Footprint: SMD2835; JLCPCB Part Class: 扩展库; Datasheet: https://atta.szlcsc.com/upload/public/pdf/source/20200909/C210311_665F1F7249D0499297E45CA2E817FB65.pdf; Supplier: LCSC; Emitted Color: 白色; Forward Voltage (VF): 3.4V; Power Dissipation: 306mW; Forward Current: 60mA; Lens Color: 雾状黄透镜; Color Temperature: 4000K; Viewing Angle: 120°; Mounting Sytle: 正贴; Operating Temperature: -40℃~+85℃
Q1 Q9 Q10 = AO3400A_C347475: 类型:1个N沟道;漏源电压(Vdss):30V;连续漏极电流(Id):5.8A;功率(Pd):1.4W;导通电阻(RDS(on)@Vgs,Id):35mΩ@10V,5.8A;阈值电压(Vgs(th)@Id):1.4V@250uA;; LCSC Part Name: 1个N沟道 耐压:30V 电流:5.8A; Supplier Part: C347475; Manufacturer: UMW(友台半导体); Supplier Footprint: SOT-23; JLCPCB Part Class: 扩展库; Datasheet: https://atta.szlcsc.com/upload/public/pdf/source/20231109/50AB4FB4D66E55864F9B8D027B723C9A.pdf; Supplier: LCSC; Type: 1个N沟道; Drain Source Voltage (Vdss): 30V; Continuous Drain Current (Id): 5.8A; Power Dissipation (Pd): 1.4W; Drain Source On Resistance (RDS(on)@Vgs,Id): 35mΩ@10V,5.8A; Gate Threshold Voltage (Vgs(th)@Id): 1.4V@250uA; Total Gate Charge (Qg@Vgs): 12nC@4.5V; Input Capacitance (Ciss@Vds): 1.05nF@15V; Operating Temperature: -55℃~+150℃@(Tj)
Q2 = 2N7002K_C414015: LCSC Part Name: 1个N沟道 耐压:60V 电流:500mA; Supplier Part: C414015; Manufacturer: MDD(辰达半导体); Supplier Footprint: SOT-23; JLCPCB Part Class: 扩展库; Datasheet: https://atta.szlcsc.com/upload/public/pdf/source/20200323/C414015_B411BFD75F9E6D6E33C8732AC1E81304.pdf; Supplier: LCSC; Type: 1个N沟道; Drain Source Voltage (Vdss): 60V; Continuous Drain Current (Id): 500mA; Power Dissipation (Pd): 300mW; Drain Source On Resistance (RDS(on)@Vgs,Id): 900mΩ@10V; Gate Threshold Voltage (Vgs(th)@Id): 1.6V@250uA; Total Gate Charge (Qg@Vgs): 930pC@10V; Input Capacitance (Ciss@Vds): 23.8pF@30V; Reverse Transfer Capacitance (Crss@Vds): 1.5pF@30V
R2-R6 R8-R10 R52-R55 R67-R71 R76-R78 R91-R96 R99 = Res_0603: Supplier Footprint: 0603
RN4 = 4D03WGJ0472T5E: 电阻器数:4;阻值:4.7kΩ;精度:±5%;单个元件功率:62.5mW;温度系数:±200ppm/℃;; LCSC Part Name: 4.7kΩ ±5%; Supplier Part: C1980; Manufacturer: UNI-ROYAL(厚声); Supplier Footprint: 0603x4; JLCPCB Part Class: 基础库; Datasheet: https://atta.szlcsc.com/upload/public/pdf/source/20191224/C474318_2527498AE30E813171187CCD28401A71.pdf; Supplier: LCSC; Number of Resistors: 4; Tolerance: ±5%; Power(Watts): 62.5mW; Temperature Coefficient: ±200ppm/℃; Number of Pins: 8
U2 = SY7200AABC: 30V 2A LED驱动 升压 效率高达96% 软启动 LED开路保护; Supplier Part: C107309; Manufacturer: silergy(矽力杰); Supplier Footprint: SOT-23-6; JLCPCB Part Class: 扩展库; Datasheet: https://atta.szlcsc.com/upload/public/pdf/source/20170925/C107309_1506321334417990079.pdf; Supplier: LCSC
U9 U11 = XC6206P282MR_C5148690: 输出类型:固定;最大输入电压:8V;输出电压:2.8V;最大输出电流:300mA;输出极性:正极;; LCSC Part Name: 输入8V 输出2.8V 300mA; Supplier Part: C5148690; Manufacturer: HXY MOSFET(华轩阳电子); Supplier Footprint: SOT-23; JLCPCB Part Class: 扩展库; Datasheet: https://atta.szlcsc.com/upload/public/pdf/source/20230315/F404BD4D78A59DDC4661E6A12EB24193.pdf; Supplier: LCSC; Output Type: 固定; Maximum Input Voltage: 8V; Output Voltage: 2.8V; MAX Output Current: 300mA; Dropout Voltage: 240mV@(50mA); Output Polarity: 正极; Number of Outputs: 1
U10 = LR8103A-T12: 输出类型:-;最大输入电压:-;输出电压:1.2V;最大输出电流:300mA;电源纹波抑制比(PSRR):-;输出极性:-;; Supplier Part: C7501644; Manufacturer: LR(朗瑞); Supplier Footprint: SOT-23-3L; JLCPCB Part Class: 扩展库; Datasheet: https://atta.szlcsc.com/upload/public/pdf/source/20231008/497C30F6FC000E28AFBC84D6E13E2470.pdf; Supplier: LCSC; Output Voltage: 1.2V; MAX Output Current: 300mA; standby current: 800nA
U12 = BLM18PG121SN1D: 标称阻抗@测试频率:120Ω@100MHz;误差:±25%;直流电阻(RDC):50mΩ;; LCSC Part Name: 单路 0603磁珠 阻抗120Ω@100MHz; Supplier Part: C14709; Manufacturer: muRata(村田); Supplier Footprint: 0603; JLCPCB Part Class: 扩展库; Datasheet: https://atta.szlcsc.com/upload/public/pdf/source/20130704/1457706621422.pdf; Supplier: LCSC; Impedance @ Frequency: 120Ω@100MHz; Tolerance: ±25%; DC Resistance: 50mΩ; Current Rating: 2A; Circuits: 1
U13 = XC6206P152MR: 输出类型:固定;最大输入电压:7V;输出电压:1.5V;最大输出电流:60mA;电源纹波抑制比(PSRR):-;输出极性:正极;; LCSC Part Name: 输入7V 输出1.5V 60mA; Supplier Part: C424701; Manufacturer: TOREX(特瑞仕); Supplier Footprint: SOT-23; JLCPCB Part Class: Extended Part; Datasheet: https://atta.szlcsc.com/upload/public/pdf/source/20200117/C484266_EE638359EA530088949E891FD0EEEA32.pdf; Supplier: LCSC; Output Type: 固定; Maximum Input Voltage: 7V; Output Voltage: 1.5V; MAX Output Current: 60mA; Dropout Voltage: 860mV@(60mA); Output Polarity: 正极; Number of Outputs: 1
U17 = MPU-6050: 三轴加速度计和三轴陀螺仪，工作电压：2.375V~3.46V; Supplier Part: C24112; Manufacturer: TDK InvenSense(应美盛); Supplier Footprint: QFN-24(4x4); JLCPCB Part Class: 基础库; Datasheet: https://atta.szlcsc.com/upload/public/pdf/source/20140425/1457707046159.pdf; Supplier: LCSC
U18 = LTR-553ALS-01: LCSC Part Name: 三合一光传感器; Supplier Part: C492375; Manufacturer: LITEON(光宝); Supplier Footprint: SMD-8P; JLCPCB Part Class: 扩展库; Datasheet: https://atta.szlcsc.com/upload/public/pdf/source/20230202/67716E17D8A63F3EE195427B50C540A2.pdf; Supplier: LCSC
D2 = SR05_C521962: Supplier: LCSC; Supplier Part: C521962; Manufacturer: TECH PUBLIC(台舟); JLCPCB Part Class: 扩展库; Supplier Footprint: SOT-143-4; Datasheet: https://atta.szlcsc.com/upload/public/pdf/source/20210810/DE8C9F15154892909ECFEE94FF023C89.pdf
KEY_DWN KEY_PWR KEY_UP = YTS1C0033BBG01: 带定位柱 支架; LCSC Part Name: 侧按键3x6x3.8 黑钮贴片; Supplier Part: C5188566; Manufacturer: YIYUAN(怡远); Supplier Footprint: SMD; JLCPCB Part Class: 扩展库; Datasheet: https://atta.szlcsc.com/upload/public/pdf/source/20230613/7D2A610AF4C94741A450B980E2010797.pdf; Supplier: LCSC
R7 = 0603WAF1005T5E: 电阻类型:厚膜电阻;阻值:10MΩ;精度:±1%;功率:100mW;最大工作电压:75V;温度系数:±100ppm/℃;; LCSC Part Name: 10MΩ ±1% 100mW 厚膜电阻; Supplier Part: C7250; Manufacturer: UNI-ROYAL(厚声); Supplier Footprint: 0603; JLCPCB Part Class: 基础库; Datasheet: https://atta.szlcsc.com/upload/public/pdf/source/20200306/C422600_1E6D84923E4A46A82E41ADD87F860B5C.pdf; Supplier: LCSC; Type: 厚膜电阻; Tolerance: ±1%; Power(Watts): 100mW; Overload Voltage (Max): 75V; Temperature Coefficient: ±100ppm/℃; Operating Temperature Range: -55℃~+155℃
RN1 RN5 = 4D03WGJ0103T5E: 电阻器数:4;阻值:10kΩ;精度:±5%;单个元件功率:62.5mW;温度系数:±200ppm/℃;; LCSC Part Name: 10kΩ ±5%; Supplier Part: C29718; Manufacturer: UNI-ROYAL(厚声); Supplier Footprint: 0603x4; JLCPCB Part Class: 基础库; Datasheet: https://atta.szlcsc.com/upload/public/pdf/source/20191224/C474318_2527498AE30E813171187CCD28401A71.pdf; Supplier: LCSC; Number of Resistors: 4; Tolerance: ±5%; Power(Watts): 62.5mW; Temperature Coefficient: ±200ppm/℃; Number of Pins: 8
RN2 RN3 = 4D03WGF4702T5E: 电阻器数:4;阻值:47kΩ;精度:±1%;单个元件功率:62.5mW;温度系数:±200ppm/℃;; LCSC Part Name: 47kΩ ±1%; Supplier Part: C425205; Manufacturer: UNI-ROYAL(厚声); Supplier Footprint: 0603x4; JLCPCB Part Class: 扩展库; Datasheet: https://atta.szlcsc.com/upload/public/pdf/source/20191224/C474318_2527498AE30E813171187CCD28401A71.pdf; Supplier: LCSC; Number of Resistors: 4; Tolerance: ±1%; Power(Watts): 62.5mW; Temperature Coefficient: ±200ppm/℃; Number of Pins: 8
SW1-SW4 = TS-1088R-02026: LCSC Part Name: 3.9*2.93*2mm 立贴 轻触开关; Supplier Part: C455280; Manufacturer: XUNPU(讯普); Supplier Footprint: SMD,3x4mm; JLCPCB Part Class: 扩展库; Datasheet: https://atta.szlcsc.com/upload/public/pdf/source/20191118/C455281_EC5379764BC1462550DF64BBBFEA9579.pdf; Supplier: LCSC; Circuit: 单刀单掷; Actuator Style: 圆形按钮; Mounting Style: 立贴; Switch Length: 3.9mm; Switch Width: 2.93mm; Switch Height: 2mm; Contact Current: 50mA; Voltage Rating (DC): 12V
U1 = D131C-QFN88: PCB DECAL: QFN88; Part_Type: AIC1603; Part_Number: D131CBV; ID: 25; Source_Path: \\DSERVER.ARTMEM.COM\AIC\DEPT\SD\SHARE\CADENCE CIS\LIBRARY\OLB-QIN\AIC_CHIP_V01.OLB; Library Name: *
U6 = W25Q128JVSIQ: 接口类型:-;存储容量:128Mbit;时钟频率(fc):-;; LCSC Part Name: W25Q128JVSIQ 编带; Supplier Part: C97521; Manufacturer: WINBOND(华邦); Supplier Footprint: SOIC-8-208mil; JLCPCB Part Class: 基础库; Datasheet: https://atta.szlcsc.com/upload/public/pdf/source/20170316/1489627409956.pdf; Supplier: LCSC; Memory Size: 128Mbit
U7 = 1N5819W_C5451628: 二极管配置:独立式;正向压降(Vf):600mV@200mA;直流反向耐压(Vr):40V;平均整流电流(Io):350mA;; LCSC Part Name: 电压:40V 电流:350mA; Supplier Part: C5451628; Manufacturer: HXY MOSFET(华轩阳电子); Supplier Footprint: SOD-123; JLCPCB Part Class: 扩展库; Datasheet: https://atta.szlcsc.com/upload/public/pdf/source/20230718/8CE4C7F16758863028CFFFD6944BDCD1.pdf; Supplier: LCSC; Diode Configuration: 独立式; Forward Voltage (Vf@If): 600mV@200mA; Reverse Voltage (Vr): 40V; Average Rectified Current (Io): 350mA; Reverse Leakage Current (Ir): 5uA@30V; Peak forward surge current: 2A
U24 = TF-123-ARP9H15: 卡连接方式:拔插式;卡类型:MicroSD卡(TF卡);连接器类型:卡座;本体最大高度:1.5mm;触头材质:磷铜;触头镀层:金;工作温度范围:-25℃~+85℃;焊接温度(最大值):260℃;; LCSC Part Name: 拔插式 MicroSD卡(TF卡) 卡座; Supplier Part: C2982547; Manufacturer: XUNPU(讯普); Supplier Footprint: SMD; JLCPCB Part Class: 扩展库; Datasheet: https://atta.szlcsc.com/upload/public/pdf/source/20220311/12D4DAC699E408EFF19FAC6014C660FF.pdf; Supplier: LCSC; Card Connection Mode: 拔插式; Card Type: MicroSD卡(TF卡); Connector Type: 卡座; Maximum Body Height: 1.5mm; Contact Material: 磷铜; Contact Plating: 金; Operating Temperature Range: -25℃~+85℃; Soldering Temperature(Max): 260℃
X1 = X322524MOB4SI: 晶振类型:贴片晶振;频率:24MHz;常温频差:±10ppm;外接负载电容:12pF;频率稳定度(全温):±30ppm;; LCSC Part Name: 24MHz ±10ppm 12pF; Supplier Part: C70590; Manufacturer: YXC(扬兴晶振); Supplier Footprint: SMD3225-4P; JLCPCB Part Class: 扩展库; Datasheet: https://atta.szlcsc.com/upload/public/pdf/source/20230512/FCFA71FC9F356FF871B9CC5C5DAC5D5F.pdf; Supplier: LCSC; Crystal Type: 贴片晶振; Normal temperature Frequency Tolerance: ±10ppm; External load capacitor: 12pF; Frequency Stability(Full temperature range): ±30ppm; Operating Temperature: -40℃~+85℃
X2 = X321532768KGD2SI: 晶振类型:贴片晶振;频率:32.768kHz;常温频差:±20ppm;外接负载电容:12.5pF;频率稳定度(全温):-;; LCSC Part Name: 32.768kHz ±20ppm 12.5pF; Supplier Part: C620155; Manufacturer: YXC(扬兴晶振); Supplier Footprint: SMD3215-2P; JLCPCB Part Class: 扩展库; Datasheet: https://atta.szlcsc.com/upload/public/pdf/source/20240329/3A7650FD985DD0DE85694D3785AB4916.pdf; Supplier: LCSC; Crystal Type: 贴片晶振; Normal temperature Frequency Tolerance: ±20ppm; External load capacitor: 12.5pF; Operating Temperature: -40℃~+85℃
C151-C153 C158 C159 = CAP_1206: Supplier Footprint: 1206
C155 C156 = CAP_0805: Supplier Footprint: 0805
C165 C166 C170 = TLJB227M006R0500: LCSC Part Name: 220uF ±20% 6.3V; Supplier Part: C30242; Manufacturer: Kyocera AVX; Supplier Footprint: CASE-B-3528; JLCPCB Part Class: 扩展库; Datasheet: https://atta.szlcsc.com/upload/public/pdf/source/20181016/C313517_95E099C94D57B8A6005DAF15C3058A23.pdf; Supplier: LCSC; Tolerance: ±20%; Rated Voltage: 6.3V; Equivalent Series Resistance(ESR): 500mΩ@100kHz; Operating Temperature: -55℃~+125℃
C179 C180 C182 = CL21A226MAQNNNE: 容值:22uF;精度:±20%;额定电压:25V;材质(温度系数):X5R;; LCSC Part Name: 22uF ±20% 25V; Supplier Part: C45783; Manufacturer: SAMSUNG(三星); Supplier Footprint: 0805; JLCPCB Part Class: 基础库; Datasheet: https://atta.szlcsc.com/upload/public/pdf/source/20160218/1457707763339.pdf; Supplier: LCSC; Tolerance: ±20%; Voltage Rated: 25V; Temperature Coefficient: X5R
CN2 = 1.25-2PWB: 插针结构:1x2P;间距:1.25mm;安装方式:卧贴;参考系列:-;总PIN数:2P;排数:1;每排PIN数:2;行距:-;额定电流:-;工作温度范围:-40℃~+85℃;; LCSC Part Name: 1x2P 间距:1.25mm 卧贴; Supplier Part: C2905009; Manufacturer: DEALON(德艺隆); Supplier Footprint: SMD,P=1.25mm,卧贴; JLCPCB Part Class: 扩展库; Datasheet: https://atta.szlcsc.com/upload/public/pdf/source/20231123/1AE0876AE9C7DCFC0D68EAC4CBA881B0.pdf; Supplier: LCSC; Pins Structure: 1x2P; Pitch: 1.25mm; Mounting Style: 卧贴; Number of Pins: 2P; Number of Rows: 1; Number of PINs Per Row: 2; Operating Temperature Range: -40℃~+85℃
CN3 = A1002WR-S-6P: 参考系列:SH;间距:1mm;插针结构:1x6P;排数:1;每排PIN数:6;行距:-;安装方式:-;触头材质:磷青铜;; LCSC Part Name: 系列:SH 间距:1mm 1x6P; Supplier Part: C239524; Manufacturer: CJT(长江连接器); Supplier Footprint: SMD,P=1mm; JLCPCB Part Class: 扩展库; Datasheet: https://atta.szlcsc.com/upload/public/pdf/source/20190523/C338919_26A19BC9BEDA3DBF5CB743676AAF20C3.pdf; Supplier: LCSC; Reference Series: SH; Pitch: 1mm; Pins Structure: 1x6P; Number of Rows: 1; Number of PINs Per Row: 6; Contact Material: 磷青铜
D3 = SS34_C8678: LCSC Part Name: 电压:40V 电流:3A; Supplier Part: C8678; Manufacturer: MDD; Supplier Footprint: SMA(DO-214AC); JLCPCB Part Class: 基础库; Datasheet: https://atta.szlcsc.com/upload/public/pdf/source/20230314/A80AE34493C69B89E2F4B1712F433538.pdf; Supplier: LCSC; Diode Configuration: 独立式; Forward Voltage (Vf@If): 550mV@3A; Reverse Voltage (Vr): 40V; Average Rectified Current (Io): 3A; Reverse Leakage Current (Ir): 500uA@40V
D4 D6 = B5819W SL: LCSC Part Name: 电压:40V 电流:1A; Supplier Part: C8598; Manufacturer: CJ(江苏长电/长晶); Supplier Footprint: SOD-123; JLCPCB Part Class: 基础库; Datasheet: https://atta.szlcsc.com/upload/public/pdf/source/20171228/C164911_15144413243851213914.pdf; Supplier: LCSC; Forward Voltage (Vf@If): 600mV@1A; Reverse Voltage (Vr): 40V; Rectified Current: 1A
D5 = 1N5819HW-7-F: LCSC Part Name: 电压:40V 电流:1A; Supplier Part: C82544; Manufacturer: DIODES(美台); Supplier Footprint: SOD-123; JLCPCB Part Class: 扩展库; Datasheet: https://atta.szlcsc.com/upload/public/pdf/source/20161024/1477288459223.pdf; Supplier: LCSC; Forward Voltage (Vf@If): 450mV@1A; Reverse Voltage (Vr): 40V; Average Rectified Current (Io): 1A; Reverse Leakage Current (Ir): 1mA@40V
D7 D8 = 1N5819WS_C191023: 正向压降(Vf):600mV@1A;直流反向耐压(Vr):40V;平均整流电流(Io):1A;; LCSC Part Name: 电压:40V 电流:1A; Supplier Part: C191023; Manufacturer: Hottech(合科泰); Supplier Footprint: SOD-323; JLCPCB Part Class: 基础库; Datasheet: https://atta.szlcsc.com/upload/public/pdf/source/20220428/3CB86FD8D28D653594B4E35F9D5AEFD9.pdf; Supplier: LCSC; Forward Voltage (Vf@If): 600mV@1A; Reverse Voltage (Vr): 40V; Average Rectified Current (Io): 1A
D9 = PMEG6020ELRX: 正向压降(Vf):760mV@2A;直流反向耐压(Vr):60V;平均整流电流(Io):2A;; LCSC Part Name: 电压:60V 电流:2A; Supplier Part: C478000; Manufacturer: Nexperia(安世); Supplier Footprint: SOD-123W; JLCPCB Part Class: 扩展库; Datasheet: https://atta.szlcsc.com/upload/public/pdf/source/20200102/C478000_8FA887C86655D319406287669DBD2C84.pdf; Supplier: LCSC; Forward Voltage (Vf@If): 760mV@2A; Reverse Voltage (Vr): 60V; Average Rectified Current (Io): 2A; Reverse Leakage Current (Ir): 300nA@60V
L6 L10 = FNR3015S2R2MT: 电感值:2.2uH;精度:±20%;额定电流:2A;饱和电流(Isat):2A;; LCSC Part Name: 2.2uH ±20% 2A; Supplier Part: C167747; Manufacturer: cjiang(长江微电); Supplier Footprint: SMD,3x3mm; JLCPCB Part Class: 扩展库; Datasheet: https://atta.szlcsc.com/upload/public/pdf/source/20190327/C167925_9EFF0AABC4CA629C2CC95961DBF7D39D.pdf; Supplier: LCSC; Tolerance: ±20%; Rated Current: 2A; Saturation Current (Isat): 2A; DC Resistance (DCR): 78mΩ
L11 = FXL0420-4R7-M: LCSC Part Name: 4.7uH ±20% 3A; Supplier Part: C167208; Manufacturer: cjiang(长江微电); Supplier Footprint: SMD,4.2x4.4mm; JLCPCB Part Class: 扩展库; Datasheet: https://atta.szlcsc.com/upload/public/pdf/source/20230516/FBADA9890E7FBE97C620F1D8B562D733.pdf; Supplier: LCSC; Tolerance: ±20%; Rated Current: 2.8A; Saturation Current (Isat): 3A; DC Resistance (DCR): 105mΩ; Type: 一体成型电感
L12 = SLM20122R2MIT: LCSC Part Name: 2.2uH ±20%; Supplier Part: C216156; Manufacturer: Sunltech(韩国顺磁); Supplier Footprint: 0805; JLCPCB Part Class: 扩展库; Datasheet: https://atta.szlcsc.com/upload/public/pdf/source/20180528/C216156_746607D01E5EB4C50E0D2BE40685D2FE.pdf; Supplier: LCSC; Tolerance: ±20%; Rated Current: 900mA; DC Resistance (DCR): 200mΩ
L13 = SWPA4030S100MT: 电感值:10uH;精度:±20%;额定电流:1.5A;饱和电流(Isat):2.4A;类型:-;; LCSC Part Name: 10uH ±20% 2.4A; Supplier Part: C38117; Manufacturer: Sunlord(顺络); Supplier Footprint: SMD; JLCPCB Part Class: 扩展库; Datasheet: https://atta.szlcsc.com/upload/public/pdf/source/20231024/317626D2AA2F8AB4113C1875E432E6E1.pdf; Supplier: LCSC; Tolerance: ±20%; Rated Current: 1.5A; Saturation Current (Isat): 2.4A; DC Resistance (DCR): 130mΩ
LED2 = LED_0603-R: Supplier Footprint: 0603
LED3 = LED_0603-G: Supplier Footprint: 0603
MOT1 = LCM1027A2445F: LCSC Part Name: 扁平1027 振动马达; Supplier Part: C2759984; Manufacturer: LEADER(立得); JLCPCB Part Class: 扩展库; Datasheet: https://atta.szlcsc.com/upload/public/pdf/source/20210326/C2759984_5008EC97BD438BDFB6866D31635439F4.pdf; Supplier: LCSC; Type: 扁平振动马达; Rated Voltage: 3V; Rated Current: 80mA; Rated Speed: 10000rpm; Operating Temperature: -20℃~+60℃; Sense Of Rotation: CW；CCW
Q3 Q5-Q8 = AO3401A_C15127: LCSC Part Name: 1个P沟道 耐压:30V 电流:4A; Supplier Part: C15127; Manufacturer: AOS; Supplier Footprint: SOT-23; JLCPCB Part Class: 基础库; Datasheet: https://atta.szlcsc.com/upload/public/pdf/source/20160507/1462613609053.pdf; Supplier: LCSC; Type: 1个P沟道; Drain Source Voltage (Vdss): 30V; Continuous Drain Current (Id): 4A; Power Dissipation (Pd): 1.4W; Drain Source On Resistance (RDS(on)@Vgs,Id): 44mΩ@10V,4.3A; Gate Threshold Voltage (Vgs(th)@Id): 1.3V@250uA; Total Gate Charge (Qg@Vgs): 12.2nC@4.5V; Input Capacitance (Ciss@Vds): 1.2nF@15V; Operating Temperature: -55℃~+150℃@(Tj)
R43 R47 R81 = 0603WAF6802T5E: LCSC Part Name: 68KΩ(6802) ±1% 编带; Supplier Part: C23231; Manufacturer: UNI-ROYAL(厚声); Supplier Footprint: 0603; JLCPCB Part Class: 基础库; Datasheet: https://atta.szlcsc.com/upload/public/pdf/source/20170920/C23231_1505901145876982612.pdf; Supplier: LCSC
R56 = FRL1206FR400TS: 电阻类型:厚膜电阻;阻值:400mΩ;精度:±1%;功率:250mW;最大工作电压:500V;温度系数:±300ppm/℃;; LCSC Part Name: 400mΩ ±1% 250mW 厚膜电阻; Supplier Part: C2907356; Manufacturer: FOJAN(富捷); Supplier Footprint: 1206; JLCPCB Part Class: 扩展库; Datasheet: https://atta.szlcsc.com/upload/public/pdf/source/20211221/925EC7D7225764EE0046F22065062C87.pdf; Supplier: LCSC; Type: 厚膜电阻; Tolerance: ±1%; Power(Watts): 250mW; Overload Voltage (Max): 500V; Temperature Coefficient: ±300ppm/℃; Operating Temperature Range: -55℃~+155℃
R57 = 0603WAF1501T5E: 电阻类型:厚膜电阻;阻值:1.5kΩ;精度:±1%;功率:100mW;最大工作电压:75V;温度系数:±100ppm/℃;; LCSC Part Name: 1.5kΩ ±1% 100mW 厚膜电阻; Supplier Part: C22843; Manufacturer: UNI-ROYAL(厚声); Supplier Footprint: 0603; JLCPCB Part Class: 基础库; Datasheet: https://atta.szlcsc.com/upload/public/pdf/source/20200306/C422600_1E6D84923E4A46A82E41ADD87F860B5C.pdf; Supplier: LCSC; Type: 厚膜电阻; Tolerance: ±1%; Power(Watts): 100mW; Overload Voltage (Max): 75V; Temperature Coefficient: ±100ppm/℃; Operating Temperature Range: -55℃~+155℃
TP1 TP2 = Test-Point: Test Point 测试点
U8 = CH571
U14 = TP4056-42-ESOP8: 锂电池充电芯片 42代表电池满电电压4.2V。; Supplier Part: C16581; Manufacturer: TOPPOWER(南京拓微); Supplier Footprint: ESOP-8; JLCPCB Part Class: 扩展库; Datasheet: https://atta.szlcsc.com/upload/public/pdf/source/20190626/C16581_611BCF5D7CF554EAE465137A8F68DB3E.pdf; Supplier: LCSC
U25 U31 = TLV62569DBVR: 功能类型:降压型;输出类型:可调;输入电压:2.5V~5.5V;输出电压:600mV~5.5V;输出电流(最大值):2A;; Supplier Part: C141836; Manufacturer: TI(德州仪器); Supplier Footprint: SOT-23-5; JLCPCB Part Class: 扩展库; Datasheet: https://www.ti.com/cn/lit/gpn/tlv62569; Supplier: LCSC; Function: 降压型; Output Type: 可调; Input Voltage: 2.5V~5.5V; Output Voltage: 600mV~5.5V; Output Current (Max): 2A; Switching Frequency: 1.5MHz; Operating Temperature: -40℃~+125℃@(TJ); Synchronous Rectification: 是; Topology: 降压式; Switch tube (built-in/external): 内置
U26 = MT3608: 功能类型:升压型;输入电压:2V~24V;输出电压:28V;输出电流(最大值):-;; Supplier Part: C84817; Manufacturer: 西安航天民芯; Supplier Footprint: SOT-23-6; JLCPCB Part Class: 扩展库; Datasheet: https://atta.szlcsc.com/upload/public/pdf/source/20161110/1478743351706.pdf; Supplier: LCSC; Function: 升压型; Input Voltage: 2V~24V; Output Voltage: 28V; Switching Frequency: 1.2MHz; Number of Outputs: 1; Topology: 升压式; Switch tube (built-in/external): 内置
U32 = ANT3216LL00R2400A: 2.4 - 2.5 GHz; Supplier Part: C293767; Manufacturer: YAGEO(国巨); Supplier Footprint: 1206; JLCPCB Part Class: Extended Part; Datasheet: https://atta.szlcsc.com/upload/public/pdf/source/20181012/C293767_CDE82A2F74DC82A94DB708CB53B68F23.pdf; Supplier: LCSC
U33 = XC6206-3.3V: 输出类型:固定;输出极性:正;最大输入电压:6V;输出电压:3.3V;输出电流:250mA;; Supplier Part: C2891841; Manufacturer: YONGYUTAI(永裕泰); Supplier Footprint: SOT-23-3L; JLCPCB Part Class: Extended Part; Datasheet: https://atta.szlcsc.com/upload/public/pdf/source/20210901/DE3C77F0CE73FFE8F7C655BE9B94CB06.pdf; Supplier: LCSC; Output Type: 固定; Output Polarity: 正; Number of Outputs: 1; Maximum Input Voltage: 6V; Output Voltage: 3.3V; Output Current: 250mA; Operating Temperature: -40℃~+85℃
U39 = LGS5145: 功能类型:降压型;输出类型:可调;输入电压:4.5V~55V;输出电压:800mV~40V;输出电流(最大值):1A;; Supplier Part: C5123971; Manufacturer: Legend-Si(棱晶半导体); Supplier Footprint: SOT-23-6; JLCPCB Part Class: 扩展库; Datasheet: https://atta.szlcsc.com/upload/public/pdf/source/20230407/AF0D76B6B755358F740E4FC32952FD3E.pdf; Supplier: LCSC; Function: 降压型; Output Type: 可调; Input Voltage: 4.5V~55V; Output Voltage: 800mV~40V; Output Current (Max): 1A; Switching Frequency: 1.2MHz; Operating Temperature: -40℃~+125℃@(TJ); Synchronous Rectification: 否; Number of Outputs: 1; Topology: 降压式; Quiescent Current (Iq): 150uA; Switch tube (built-in/external): 内置
USB3 = TYPE-C 16P CB0.8 073: 连接器类型:Type-C;标准:-;公母:母;端口数量:1;触点数量:16P;安装方式:沉板;额定电流 - 电源:3A;工作温度范围:-25℃~+85℃;; LCSC Part Name: Type-C 母 沉板; Supplier Part: C2906289; Manufacturer: SHOU HAN(首韩); Supplier Footprint: SMD; JLCPCB Part Class: 扩展库; Datasheet: https://atta.szlcsc.com/upload/public/pdf/source/20211019/7FB277F3E208FF6FA6B4F1FC2FE8DDC1.pdf; Supplier: LCSC; Connector Type: Type-C; Gender: 母; Number of Ports: 1; Number of Contacts: 16P; Mounting Style: 沉板; Current Rating - Power (Max): 3A; Operating Temperature Range: -25℃~+85℃
X3 = X322532MOB4SI: 频率:32MHz;频率公差:±10ppm;负载电容:12pF;; LCSC Part Name: 32MHz ±10ppm 12pF YSX321SL; Supplier Part: C9009; Manufacturer: YXC(扬兴晶振); Supplier Footprint: SMD3225-4P; JLCPCB Part Class: Extended Part; Datasheet: https://atta.szlcsc.com/upload/public/pdf/source/20210329/C112971_1F611BDC486E193C1706F6D8EB5AA189.pdf; Supplier: LCSC; Crystal Type: 贴片无源晶振; Frequency Tolerance: ±10ppm; Frequency Stability: ±30ppm; Load Capacitance: 12pF; Operating Temperature: -40℃~+85℃
X5 = XKXGI-SUA-32.768K: 晶振类型:贴片晶振;频率:32.768kHz;常温频差:±20ppm;外接负载电容:12.5pF;频率稳定度(全温):±30ppm;; LCSC Part Name: 32.768kHz ±20ppm 12.5pF YST310S; Supplier Part: C5213671; Manufacturer: YXC(扬兴晶振); Supplier Footprint: SMD3215-2P; JLCPCB Part Class: 扩展库; Datasheet: https://atta.szlcsc.com/upload/public/pdf/source/20240329/3A7650FD985DD0DE85694D3785AB4916.pdf; Supplier: LCSC; Crystal Type: 贴片晶振; Normal temperature Frequency Tolerance: ±20ppm; External load capacitor: 12.5pF; Frequency Stability(Full temperature range): ±30ppm; Operating Temperature: -40℃~+85℃
U34 = CH334F_C5187527: Supplier Part: C5187527; Manufacturer: WCH(南京沁恒); Supplier Footprint: QFN-24(4x4); JLCPCB Part Class: 扩展库; Datasheet: https://atta.szlcsc.com/upload/public/pdf/source/20240313/0A90B4344DBFB1B295B73A4884A13F29.pdf; Supplier: LCSC
U35 U36 = FSUSB42MUX: FSUSB42 是一款双向、小功率、两端口、高速 USB2.0 开关。它配置为双刀双掷 (DPDT) 开关，适用于两个高速 (480Mbps) 源或高速和全速 (12Mbps) 源之间的切换。FSUSB42 符合 USB2.0 的要求，具有 5.5pF 的极低导通电容 (CON)。此器件的宽带宽 (720MHz) 超过了传递第三谐波所需的带宽，因此信号边缘和相失真都特别小。卓越的沟道-沟道串扰性能还最大程度减少了干扰。FSUSB42 在该开关 I/O 引脚上包含了特殊电路，用于 VCC 供电断电 (VCC; LCSC Part Name: 小功率，两端口，高速 USB2.0 (480Mbps) 开关; Supplier Part: C11355; Manufacturer: onsemi(安森美); Supplier Footprint: MSOP-10; JLCPCB Part Class: Extended Part; Datasheet: https://atta.szlcsc.com/upload/public/pdf/source/20130225/1457706594597.pdf; Supplier: LCSC
U37 U38 = CH340K_C18208922: LCSC Part Name: CH340K 人工转编带; Supplier Part: C18208922; Manufacturer: WCH(南京沁恒); Supplier Footprint: ESSOP-10-150mil-1mm; JLCPCB Part Class: 扩展库; Datasheet: https://atta.szlcsc.com/upload/public/pdf/source/20240313/9D833A30DDFD16C064A7ADE10A944019.pdf; Supplier: LCSC
X6 = X322512MSB4SI: LCSC Part Name: 12MHz ±10ppm 20pF; Supplier Part: C9002; Manufacturer: YXC(扬兴晶振); Supplier Footprint: SMD3225-4P; JLCPCB Part Class: 基础库; Datasheet: https://atta.szlcsc.com/upload/public/pdf/source/20240329/19D5F850207469550BEB00D7DFEDBC7A.pdf; Supplier: LCSC; Crystal Type: 贴片晶振; Normal temperature Frequency Tolerance: ±10ppm; External load capacitor: 20pF; Frequency Stability(Full temperature range): ±20ppm; Operating Temperature: -40℃~+85℃

## Nets
GND: C1.2 C2.2 C3.1 C4.1 C7.1 C8.1 C9.2 C10.2 C11.2 C12.2 C13.2 C23.2 C24.2 C25.2 C26.2 C27.2 C28.2 C29.2 C30.2 C31.2 C32.1 C33.1 C34.2 C35.2 C36.2 C37.2 C38.2 C39.1 C114.2 C118.2 C121.2 C122.2 C123.2 C124.2 C125.1 C126.1 C127.1 C128.1 C129.1 C130.1 C131.1 C132.2 C133.2 C134.2 C135.2 C136.2 C138.1 C140.1 C141.2 C142.1 C143.2 C144.1 C145.2 C146.1 C147.1 C151.2 C152.2 C153.2 C155.2 C156.2 C157.2 C158.2 C159.2 C160.2 C161.1 C162.1 C163.2 C164.2 C165.2 C166.2 C167.2 C168.2 C169.2 C170.2 C171.2 C172.1 C173.1 C174.1 C175.1 C176.1 C177.1 C178.2 C179.2 C180.2 C182.1 CAM1.2(AGND) CAM1.15(DGND) CAM1.23(AF-GND) CAM1.25(DGND) CAM1.26(DGND) CN2.1 CN2.3 CN2.4 CN3.6 CN3.7 CN3.8 D2.1 D9.2(A) FPC1.1 FPC1.7 FPC1.8 FPC1.11 FPC1.14 FPC1.17 FPC1.20 FPC1.23 FPC1.26 FPC1.33 FPC1.34 FPC1.35 FPC2.8 FPC2.10 FPC2.11 FPC2.12 FPC3.2 FPC3.11 FPC3.12 KEY_DWN.2 KEY_DWN.3 KEY_DWN.4 KEY_PWR.2 KEY_PWR.3 KEY_PWR.4 KEY_UP.2 KEY_UP.3 KEY_UP.4 Q1.2(S) Q2.2(S) Q9.2(S) Q10.2(S) R3.1 R4.1 R5.2 R10.1 R44.1 R48.1 R55.1 R57.2 R61.1 R69.2 R70.2 R71.2 R78.2 R82.1 R97.1 R101.1 RN5.6 RN5.7 SW1.2 SW2.1 SW3.2 SW4.2 TP2.1 U1.89(GND) U2.2(GND) U6.4(GND) U8.29(PAD) U9.1(VSS) U10.1(GND) U11.1(VSS) U13.1(VSS) U14.1(TEMP) U14.3(GND) U14.9(EP) U15.3(GND) U16.7(GND) U17.1(CLKIN) U17.9(AD0) U17.11(FSYNC) U17.18(GND) U17.25(GND) U18.6(GND) U22.3(GND) U23.2(L/R) U23.3(GND) U24.6(VSS) U25.2(GND) U26.2(GND) U31.2(GND) U33.1(VSS) U34.25(GND) U35.5(GND) U36.5(GND) U37.3(GND) U37.11(GND) U38.3(GND) U38.11(GND) U39.2(GND) USB3.A1B12(GND) USB3.B1A12(GND) X1.2(GND) X1.4(GND) X3.2(GND) X3.4(GND) X6.2(GND) X6.4(GND)
VBAT: C132.1 C158.1 C159.1 CN2.2 D5.1(K) MOT1.2(+) Q3.2(S) Q5.2(S) R60.2 R79.1 R84.1 RN5.5 U14.5(BAT)
VCC_1V1: C23.1 C24.1 C25.1 C38.1 C118.1 C166.1 C168.1 L10.2 R47.2 U1.8(VDD11_SYS1) U1.30(VDD11_SYS2) U1.68(VDD11_SYS3)
VCC_1V2: C124.1 C129.2 C130.2 CAM1.10(DVDD) U10.2(VOUT) U13.2(VOUT)
VCC_3V3: C29.1 C30.1 C31.1 C32.2 C33.2 C36.1 C37.1 C39.2 C114.1 C121.1 C123.1 C128.2 C144.2 C145.1 C146.2 C147.2 C161.2 C162.2 C163.1 C164.1 C165.1 C167.1 C173.2 C174.2 C175.2 C176.2 C177.2 FPC1.27 FPC1.28 FPC2.1 FPC2.2 FPC3.1 L6.2 R6.2 R9.2 R43.2 R52.2 R65.2 R67.2 R68.2 R76.1 R95.1 R96.1 RN1.5 RN1.6 RN1.7 RN1.8 RN2.1 RN2.2 RN2.3 RN2.4 RN3.1 RN3.2 RN3.3 RN3.4 RN4.5 RN4.6 RN4.7 RN4.8 U1.15(VCC33_IO0) U1.36(VCC33_IO1) U1.69(VCC33_IO2) U6.8(VCC) U7.1(A) U9.3(VIN) U10.3(VIN) U12.2 U17.8(VLOGIC) U17.13(VDD) U18.5(LED A) U18.8(VDD) U22.2(L/R) U22.5(VDD) U23.5(VDD) U24.4(VDD) U34.19(V5) U34.20(VDD33) U35.1(VCC) U36.1(VCC) U37.7(VCC) U37.10(V3) U38.7(VCC) U38.10(V3)
VCC_AF: C122.1 CAM1.24(AF-VCC) U9.2(VOUT)
VCC_BST: L11.1 Q5.3(D) U26.4(EN) U26.5(IN)
VCC_CH: C13.1 C172.2 U8.5(VIO33/VDD33) U33.2(VOUT)
VCC_CHG: Q8.3(D) R56.1
VCC_USB: D2.4 D8.1(K) Q6.2(S) Q7.3(D) Q8.2(S) R86.1 R90.1 RN5.8 USB3.A4B9(VBUS) USB3.B4A9(VBUS)
VCC_WILE: C182.2 D8.2(A) L13.1 R100.1
VCCSYS: C3.2 C140.2 C141.1 C151.1 C152.1 C153.1 C155.1 C156.1 C157.1 D6.2(+) L2.1 Q3.3(D) Q6.3(D) U2.6(IN) U16.6(VDD) U25.1(EN) U25.4(VIN) U31.1(EN) U31.4(VIN)
A_A4: RN5.1 RN5.2 U8.23(PA4/AIN0)
A_A5: RN5.3 RN5.4 U8.24(PA5/AIN1)
A_A8: CN3.1 R93.2 U8.6(PA8/RXD1)
A_A9: CN3.2 R94.2 U8.7(PA9/TMR0/TXD1)
A_A10: U8.2(PA10/X32KI/TMR) X5.1(OSC1)
A_A11: U8.1(PA11/X32KO/TMR) X5.2(OSC2)
A_A12: R85.1 U8.28(PA12/SCS/AIN2)
A_A13: R80.1 U8.27(PA13/SCK0/AIN3)
A_A14: R83.1 U8.26(PA14/MOSI/TXD0_/AIN4)
A_A15: R4.2 U8.25(PA15/MISO/RXD0_/AIN5) U35.2(Sel) U36.2(Sel)
A_B4: R98.2 U8.15(PB4/RXD0)
A_B7: U8.14(PB7/TXD0)
A_B10: CN3.4 U8.13(PB10/UD-/TMR1_) U34.7(DM3)
A_B11: CN3.5 U8.12(PB11/UD+/TMR2_) U34.8(DP3)
A_B12: R89.1 U8.11(PB12/SCS_/RXD1_)
A_B13: R87.1 U8.10(PB13/SCK0_/TXD1_)
A_B14: U8.9(PB14/TIO/MOSI_/DSR)
A_B15: U8.8(PB15/TCK/MISO_/DTR)
A_B22: SW3.1 U8.17(PB22/TMR3)
A_B23: SW4.1 U8.16(PB23/RST#/TMR0_)
ADC_BAT: R62.1
BUZZER: R54.2 U1.52(GPE_P11/CLK_OUT1/PWM1_A/I2S_LRCK/DMIC_D0)
CAN0_RX: FPC1.24 U1.76(GPA_P5/GPAI5/CAN0_RX/UART2_RX/RTC_32K)
CAN0_TX: R65.1 U1.75(GPA_P4/GPAI4/CAN0_TX/UART2_TX) U16.1(SHUTDOWN)
CTP_LED: R99.1 U1.62(GPB_P7/SDC0_CLK/SPI2_MISO/UART5_RX/FLASH_MISO)
CTP_LEDA: FPC1.2 R9.1
CTP_LEDK: FPC1.3 Q10.3(D)
D133_USB_DM: D2.2 U1.87(PU0/USB_DM/UART0_RX/UART1_RX) U35.4(D-) U36.8(HSD2-)
D133_USB_DP: D2.3 U1.88(PU1/USB_DP/UART0_TX/UART1_TX) U35.3(D+) U36.9(HSD2+)
DVP_CK: CAM1.17(PCLK) U1.49(GPE_P8/EMAC_MDC/DVP_CK/UART7_TX)
DVP_D0: CAM1.19(Y2) U1.41(GPE_P0/EMAC_RXD1/DVP_D0/PWM0_A/UART3_TX)
DVP_D1: CAM1.21(Y3) U1.42(GPE_P1/EMAC_RXD0/DVP_D1/PWM0_B/UART3_RX)
DVP_D2: CAM1.22(Y4) U1.43(GPE_P2/EMAC_RXCTL/DVP_D2/UART4_TX)
DVP_D3: CAM1.20(Y5) U1.44(GPE_P3/EMAC_CLKIN/DVP_D3/I2S_MCLK/UART4_RX)
DVP_D4: CAM1.18(Y6) U1.45(GPE_P4/EMAC_TXD1/DVP_D4/UART5_TX)
DVP_D5: CAM1.16(Y7) U1.46(GPE_P5/EMAC_TXD0/DVP_D5/UART5_RX)
DVP_D6: CAM1.14(Y8) U1.47(GPE_P6/EMAC_TXCK/DVP_D6/UART6_TX)
DVP_D7: CAM1.12(Y9) U1.48(GPE_P7/EMAC_TXCTL/DVP_D7/UART6_RX)
DVP_HS: CAM1.9(HREF) U1.50(GPE_P9/EMAC_MDIO/DVP_HS/UART7_RX)
DVP_VS: CAM1.7(VSYNC) U1.51(GPE_P10/CLK_OUT2/DVP_VS/I2S_DIN/DMIC_CLK)
HUB_DM1: U34.11(DM1) U35.6(HSD1-)
HUB_DM2: U34.9(DM2) U37.2(UD-)
HUB_DM4: U34.5(DM4) U38.2(UD-)
HUB_DP1: U34.12(DP1) U35.7(HSD1+)
HUB_DP2: U34.10(DP2) U37.1(UD+)
HUB_DP4: U34.6(DP4) U38.1(UD+)
HUB_IN_DM: U34.14(DMU) U36.6(HSD1-)
HUB_IN_DP: U34.15(DPU) U36.7(HSD1+)
ID: FPC2.9
IR_INT: U1.61(GPB_P6/SDC0_CMD/SPI2_CS/UART5_TX/FLASH_CS) U18.2(INT)
KEY_DN: KEY_DWN.1 U1.65(GPB_P10/SDC0_D1/SPI2_HOLD/UART7_TX)
KEY_PWR: KEY_PWR.1 U1.66(GPB_P11/SDC0_D2/SPI2_WP/SPI0_CS1/UART7_RX)
KEY_UP: KEY_UP.1 U1.64(GPB_P9/SDC0_D0/SPI2_CLK/UART7_RTS/FLASH_CLK)
LANE0_N: FPC1.12 U1.19(GPD_P18/LCD_D18/LVDS_D0N/DSI_D0N/PBUS_AD12)
LANE0_P: FPC1.13 U1.18(GPD_P19/LCD_D19/LVDS_D0P/DSI_D0P/PBUS_AD13)
LANE1_N: FPC1.18 U1.17(GPD_P20/LCD_D20/LVDS_D1N/DSI_D1N/PBUS_AD14)
LANE1_P: FPC1.19 U1.16(GPD_P21/LCD_D21/LVDS_D1P/DSI_D1/PBUS_AD15)
LANE_CLK_N: FPC1.15 U1.14(GPD_P22/LCD_D22/LVDS_D2N/DSI_CKN)
LANE_CLK_P: FPC1.16 U1.13(GPD_P23/LCD_D23/LVDS_D2P/DSI_CKP)
LCD_ID: FPC1.4
LCD_PWM: R8.1 U1.54(GPE_P13/SPI2_CS/PWM2_A/I2S_DOUT/DSPK0)
LDO_1V8: C26.1 C27.1 U1.31(LDO18)
LDO_2V5: C28.1 L9.2 U1.70(LDO25)
LED_A: C4.2 D1.2(K) FPC1.31 FPC1.32 U2.5(OVP)
LED_K: FPC1.29 FPC1.30 R3.2 U2.3(FB)
MPU_INT: U1.35(GPD_P4/LCD_D4/SPI1_CS/I2C2_SCL/UART2_TX//PBUS_AD4) U17.12(INT)
PA0: R92.2 SW2.2 U1.71(GPA_P0/GPAI0/IR_TX/I2C0_SCL/UART0_TX/CPU_NMI)
PA1: R91.2 U1.72(GPA_P1/GPAI1/IR_RX/I2C0_SDA/UART0_RX/DE_TE)
PA2: CAM1.6(RESET) U1.73(GPA_P2/GPAI2/I2C1_SCL/UART1_TX/UART2_CTS)
PA3: CAM1.8(PWDN) U1.74(GPA_P3/GPAI3/I2C1_SDA/UART1_RX/UART2_RTS)
PA8: FPC2.4 RN4.3 U1.77(GPA_P8/RTP_XP/I2C2_SCL)
PA9: FPC2.3 RN4.4 U1.78(GPA_P9/RTP_YP/I2C2_SDA)
PA10: FPC2.6 RN4.1 U1.79(GPA_P10/RTP_XN/IR_RX/JTAG_MS)
PA11: FPC2.5 RN4.2 U1.80(GPA_P11/RTP_YN/IR_TX/JTAG_CK)
PB0: RN1.4 U1.55(GPB_P0/SPI0_WP/SPI1_WP/UART4_TX) U6.3(IO2)
PB1: U1.56(GPB_P1/SPI0_MISO/SPI1_MISO/UART6_TX) U6.2(DO)
PB2: RN1.3 U1.57(GPB_P2/SPI0_CS0/SPI1_CS/UART6_RX) U6.1(CS#)
PB3: RN1.2 U1.58(GPB_P3/SPI0_HOLD/SPI1_HOLD/UART4_RX) U6.7(IO3)
PB4: U1.59(GPB_P4/SPI0_CLK/SPI1_CLK/UART6_RTS) U6.6(CLK)
PB5: U1.60(GPB_P5/SPI0_MOSI/SPI1_MOSI/UART4_RTS/UART6_CTS) U6.5(DI)
PB8: R77.1 U1.63(GPB_P8/SDC0_D3/SPI2_MOSI/UART5_RTS/UART7_CTS/FLASH_MOSI)
PC0: RN2.8 U1.1(GPC_P0/SDC1_D1/I2C2_SCL/UART3_RTS/JTAG_MS) U24.8(DAT1)
PC1: RN2.7 U1.2(GPC_P1/SDC1_D0) U24.7(DAT0)
PC2: R2.2 U24.5(CLK)
PC3: RN3.8 U1.4(GPC_P3/SDC1_CMD) U24.3(CMD)
PC4: RN3.7 U1.5(GPC_P4/SDC1_D3/I2C1_SCL/UART3_TX/UART0_RX) U24.2(CD/DAT3)
PC5: RN3.6 U1.6(GPC_P5/SDC1_D2/I2C1_SDA/UART3_RX/JTAG_CK) U24.1(DAT2)
PC6: RN2.6 U1.7(GPC_P6/SDC1_DET/I2C2_SDA/UART3_CTS/DE_TE/CLK_OUT3) U24.9(SWITCH)
PD0: CAM1.5(SIO_C) R95.2 U1.40(GPD_P0/LCD_D0/SPI3_CLK/I2C0_SCL/UART0_TX/PBUS_AD0)
PD1: CAM1.3(SIO_D) R96.2 U1.39(GPD_P1/LCD_D1/SPI3_CS/I2C0_SDA/UART0_RX/PBUS_AD1)
PD2: R68.1 U1.38(GPD_P2/LCD_D2/SPI3_MOSI/I2C1_SCL/UART1_TX/PBUS_AD2) U17.23(SCL) U18.7(SCL)
PD3: R67.1 U1.37(GPD_P3/LCD_D3/SPI3_MISO/I2C1_SDA/UART1_RX/PBUS_AD3) U17.24(SDA) U18.1(SDA)
PD5: U1.34(GPD_P5/LCD_D5/SPI1_MISO/I2C2_SDA/UART2_RX//PBUS_AD5)
PD6: U1.33(GPD_P6/LCD_D6/SPI1_MOSI/PWM0_A/DSPK0/PBUS_AD6)
PD7: U1.32(GPD_P7/LCD_D7/SPI1_CLK/PWM0_B/DSPK1/PBUS_AD7)
PD8: FPC3.3 U1.29(GPD_P8/LCD_D8/SPI1_HOLD/PWM1_A/PBUS_CLK)
PD9: FPC3.4 U1.28(GPD_P9/LCD_D9/SPI1_WP/PBUS_NCS)
PD10: FPC3.5 U1.27(GPD_P10/LCD_D10/PBUS_NADV)
PD11: FPC3.6 U1.26(GPD_P11/LCD_D11/I2S_DIN/PBUS_NWE)
PD12: FPC3.7 U1.25(GPD_P12/LCD_D12/I2S_DOUT/PBUS_NOE)
PD13: FPC3.8 U1.24(GPD_P13/LCD_D13/I2S_LRCK/CLK_OUT0)
PD14: FPC3.9 U1.23(GPD_P14/LCD_D14/I2S_BCLK/PBUS_AD8)
PD15: FPC3.10 U1.22(GPD_P15/LCD_D15/I2S_MCLK/PBUS_AD9)
PD16: R73.2 R75.2 U1.21(GPD_P16/LCD_D16/PWM1_B/DMIC_CLK/UART2_TX/PBUS_AD10)
PD17: R72.2 R74.2 U1.20(GPD_P17/LCD_D17/PWM2_A/DMIC_D0/UART2_RX/PBUS_AD11)
PD24: U1.12(GPD_P24/LCD_DCLK/LVDS_CKN/DSI_D2N)
PD25: U1.11(GPD_P25/LCD_HS/LVDS_CKP/DSI_D2P/PWM2_B)
PD26: U1.10(GPD_P26/LCD_VS/LVDS_D3N/DSI_D3N/PWM3_A)
PD27: U1.9(GPD_P27/LCD_DE/LVDS_D3P/DSI_D3P)
PE12: U1.53(GPE_P12/SPI2_CLK/PWM1_B/I2S_BCLK/DSPK1) U15.1(A) U15.2(B)
PWM_OUT: FPC1.25
RESET: C9.1 R6.1 SW1.1 U1.67(SYS_RSTN)
RTC_32K: U1.83(RTC_IO)
RTC_VCOIN: U1.84(VCOIN_RTC) U7.2(K)
RTC_XI: C35.1 R7.1 U1.86(RTC_XI) X2.1
RTC_XO: C34.1 R7.2 U1.85(RTC_XO) X2.2
SPK_+: C139.2 R66.1 U16.5(VO+)
SPK_-: U16.8(VO-)
TE: FPC1.5
U_EN: R5.1 U35.10(OE#) U36.10(OE#)
USB_DM: U36.4(D-) USB3.A7(DN1) USB3.B7(DN2)
USB_DP: U36.3(D+) USB3.A6(DP1) USB3.B6(DP2)
VOUT_5V: C169.1 C170.1 C171.1 D3.1(K) Q7.2(S) R81.2 R88.1
X24MIN: C2.1 U1.82(PLL_XI) X1.1(OSC1)
X24MOUT: C1.1 U1.81(PLL_XO) X1.3(OSC2)
$1N872: R2.1 U1.3(GPC_P2/SDC1_CLK/UART0_TX)
$2N850: D1.1(A) L2.2 U2.1(LX)
$2N855: R8.2 R10.2 U2.4(EN/PWM)
$2N1452: C125.2 C126.2 CAM1.4(AVDD) CAM1.11(DOVDD) U11.2(VOUT)
$2N1542: LED1.2 R52.1
$2N1630: LED1.1 Q1.3(D)
$2N1685: Q1.1(G) R53.2 R55.2
$2N1693: CAM1.1(STROBE) R53.1
$2N3022: C127.2 C131.2 U11.3(VIN) U12.1 U13.3(VIN)
$2N4158: CAM1.13(XCLK) R54.1
$2N5793: C142.2 U17.20(CPOUT)
$2N5830: C143.1 U17.10(REGOUT)
$2N6133: U18.3(LDR) U18.4(LED K)
$2N17489: IR1.1(A) R76.2
$2N17546: IR1.2(C) Q2.3(D)
$2N17588: Q2.1(G) R77.2 R78.1
$2N26809: Q10.1(G) R99.2
$3N669: R43.1 R44.2 U25.5(FB)
$3N4092: R57.1 U14.2(PROG)
$3N4170: LED2.1(C) U14.7(CHRG#)
$3N4219: LED3.1(C) U14.6(STDBY#)
$3N4252: LED2.2(A) R58.1
$3N4287: LED3.2(A) R59.1
$3N24673: L6.1 U25.3(SW)
$3N24810: R47.1 R48.2 U31.5(FB)
$3N24815: L10.1 U31.3(SW)
$3N26725: Q3.1(G) R79.2 R80.2
$3N28422: D3.2(A) L11.2 U26.1(SW)
$3N28679: R81.1 R82.2 U26.3(FB)
$3N28890: Q5.1(G) R83.2 R84.2
$3N29023: Q6.1(G) R85.2 R86.2
$3N29166: Q7.1(G) R87.2 R88.2
$3N29483: R70.1 USB3.B5(CC2)
$3N29485: C160.1 R69.1 USB3.0
$3N29498: R71.1 USB3.A5(CC1)
$3N29536: C134.1 R60.1 R61.2 R62.2
$3N29754: Q8.1(G) R89.2 R90.2
$3N29787: C133.1 R56.2 R58.2 R59.2 U14.4(VCC) U14.8(CE)
$3N30166: C11.1 C12.1 L12.1 U8.3(VDCID) U8.22(VDCIA)
$3N30167: C10.1 U8.20(VINTA)
$3N30171: U8.19(X32MI) X3.1(OSC1)
$3N30173: U8.18(X32MO) X3.3(OSC2)
$3N30174: U8.21(ANT) U32.1
$3N30217: L12.2 U8.4(VSW)
$3N30581: CN3.3 D4.2(+)
$3N30587: C7.2 C8.2 D4.1(-) D6.1(-) U33.3(VIN)
$3N36679: D5.2(A) MOT1.1(-) Q9.3(D)
$3N36845: Q9.1(G) R97.2 R98.1
$3N48690: D7.2(A) TP1.1
$3N48781: C178.1 C179.1 C180.1 D7.1(K) U39.4(EN) U39.5(VIN)
$3N49049: C181.2 U39.1(BST)
$3N49054: C181.1 D9.1(K) L13.2 U39.6(SW)
$3N49260: R100.2 R101.2 U39.3(FB)
$4N919: R73.1 U23.4(CLK)
$4N927: C138.2 U16.2(BYPASS) U16.3(IN+)
$4N934: R72.1 U23.1(Data)
$4N937: C135.1 L9.1 U15.5(VCC)
$4N938: R63.2 U15.4(Y)
$4N948: C139.1 R64.1 R66.2 U16.4(IN-)
$4N949: C136.1 C137.1 R63.1
$4N951: C137.2 R64.2
$4N952: R74.1 U22.1(Data)
$4N953: R75.1 U22.4(CLK)
$5N195: U34.3(XO) X6.1(OSC1)
$5N201: U34.4(XI) X6.3(OSC2)
$5N987: R91.1 U37.8(TXD)
$5N1049: R92.1 U37.9(RXD)
$5N1622: R93.1 U38.8(TXD)
$5N1623: R94.1 U38.9(RXD)

Not connected (* = marked no-connect by the designer): CAM1 27(NC)*; FPC1 6* 9* 10* 21* 22*; FPC2 7*; RN1 1*; RN2 5*; RN3 5*; U17 2(NC)* 3(NC)* 4(NC)* 5(NC)* 6(AUX_DA)* 7(AUX_CL)* 14(NC)* 15(NC)* 16(NC)* 17(NC)* 19(RESV)* 21(RESV)* 22(RESV)*; U24 10 11 12 13; U26 6(NC)*; U32 2*; U34 1(OVCUR#)* 2(NC.)* 13(LED3/SCL)* 16(RESET#/CDP)* 17(NC)* 18(PSELF)* 21(LED4/SDA)* 22(LED1)* 23(LED2)* 24(PWREN#)*; U35 8(HSD2-) 9(HSD2+); U37 4(DTR#)* 5(CTS#)* 6(RTS#)*; U38 4(DTR#)* 5(CTS#)* 6(RTS#)*; USB3 A8(SUB1)* B8(SUB2)*

## Notes on the sheets
sheet 1
- I2C0_SCL
- I2C0_SDA
- UART1_TX
- UART1_RX
- BT_UART2_RX
- BT_UART2_TX
- BT_PWR_ON
- WIFI_PWR_ON
- LCD_B3
- USB_ID
- LCD_B4
- LCD_SLEEP
- LCD_B5
- LCD_B6
- I2S_DIN
- PA_SHDN
- LCD_B7
- I2S_DOUT
- LCD_G2
- I2S_LRCK
- LCD_G3
- I2S_BCLK
- LCD_G4
- LCD_G5
- LCD_G6
- LCD_G7
- LVDS_D0N
- MIPI_DSI_D0N
- LCD_R3
- LVDS_D0P
- MIPI_DSI_D0P
- LCD_R4
- LVDS_D1N
- MIPI_DSI_D1N
- LCD_R5
- LVDS_D1P
- MIPI_DSI_D1P
- LCD_R6
- LVDS_D2N
- MIPI_DSI_CKN
- LCD_CLK
- LCD_R7
- LVDS_CKN
- LVDS_D2P
- MIPI_DSI_CKP
- MIPI_DSI_D2N
- LCD_HS
- LVDS_CKP
- MIPI_DSI_D2P
- LCD_VS
- LVDS_D3N
- MIPI_DSI_D3N
- LCD_DE
- LVDS_D3P
- MIPI_DSI_D3P
- RGB888
- LVDS
- MIPI-DSI
sheet 2
- 2.8V 3.3uH
- 1.5V 600R磁珠
- 2.8V 3.3uH
- 2.8V
sheet 3
- USB电压
- BOOST电压
- 电池电压
- 系统主电压
- 温湿度、红外接收
- BAT
- 0
- USB
- 0
- USER
- 0
- 0
- 1
- 0
- PWR2
- USB->SYS
- 1
- 0
- 0
- PWR1
- BAT->SYS
- 1
- 1
- 0
- PWR2
- PWR5
- USB->SYS
- USB->CHG
- 0
- 0
- 1
- 0
- 1
- 0
- 1
- 1
- 1
- PWR1
- PWR3
- PWR4
- BAT->SYS
- BAT->BST
- BST->USB
- 1
- 1
- 1
sheet 4
- SD18OB261-060
- LMD4737T263
sheet 5
- D133USB
- CH573USB
- USB-TYPE-C
- HUB_USB
